# Altium project ddrlegobrick.PrjPcb (part 1 of 2)
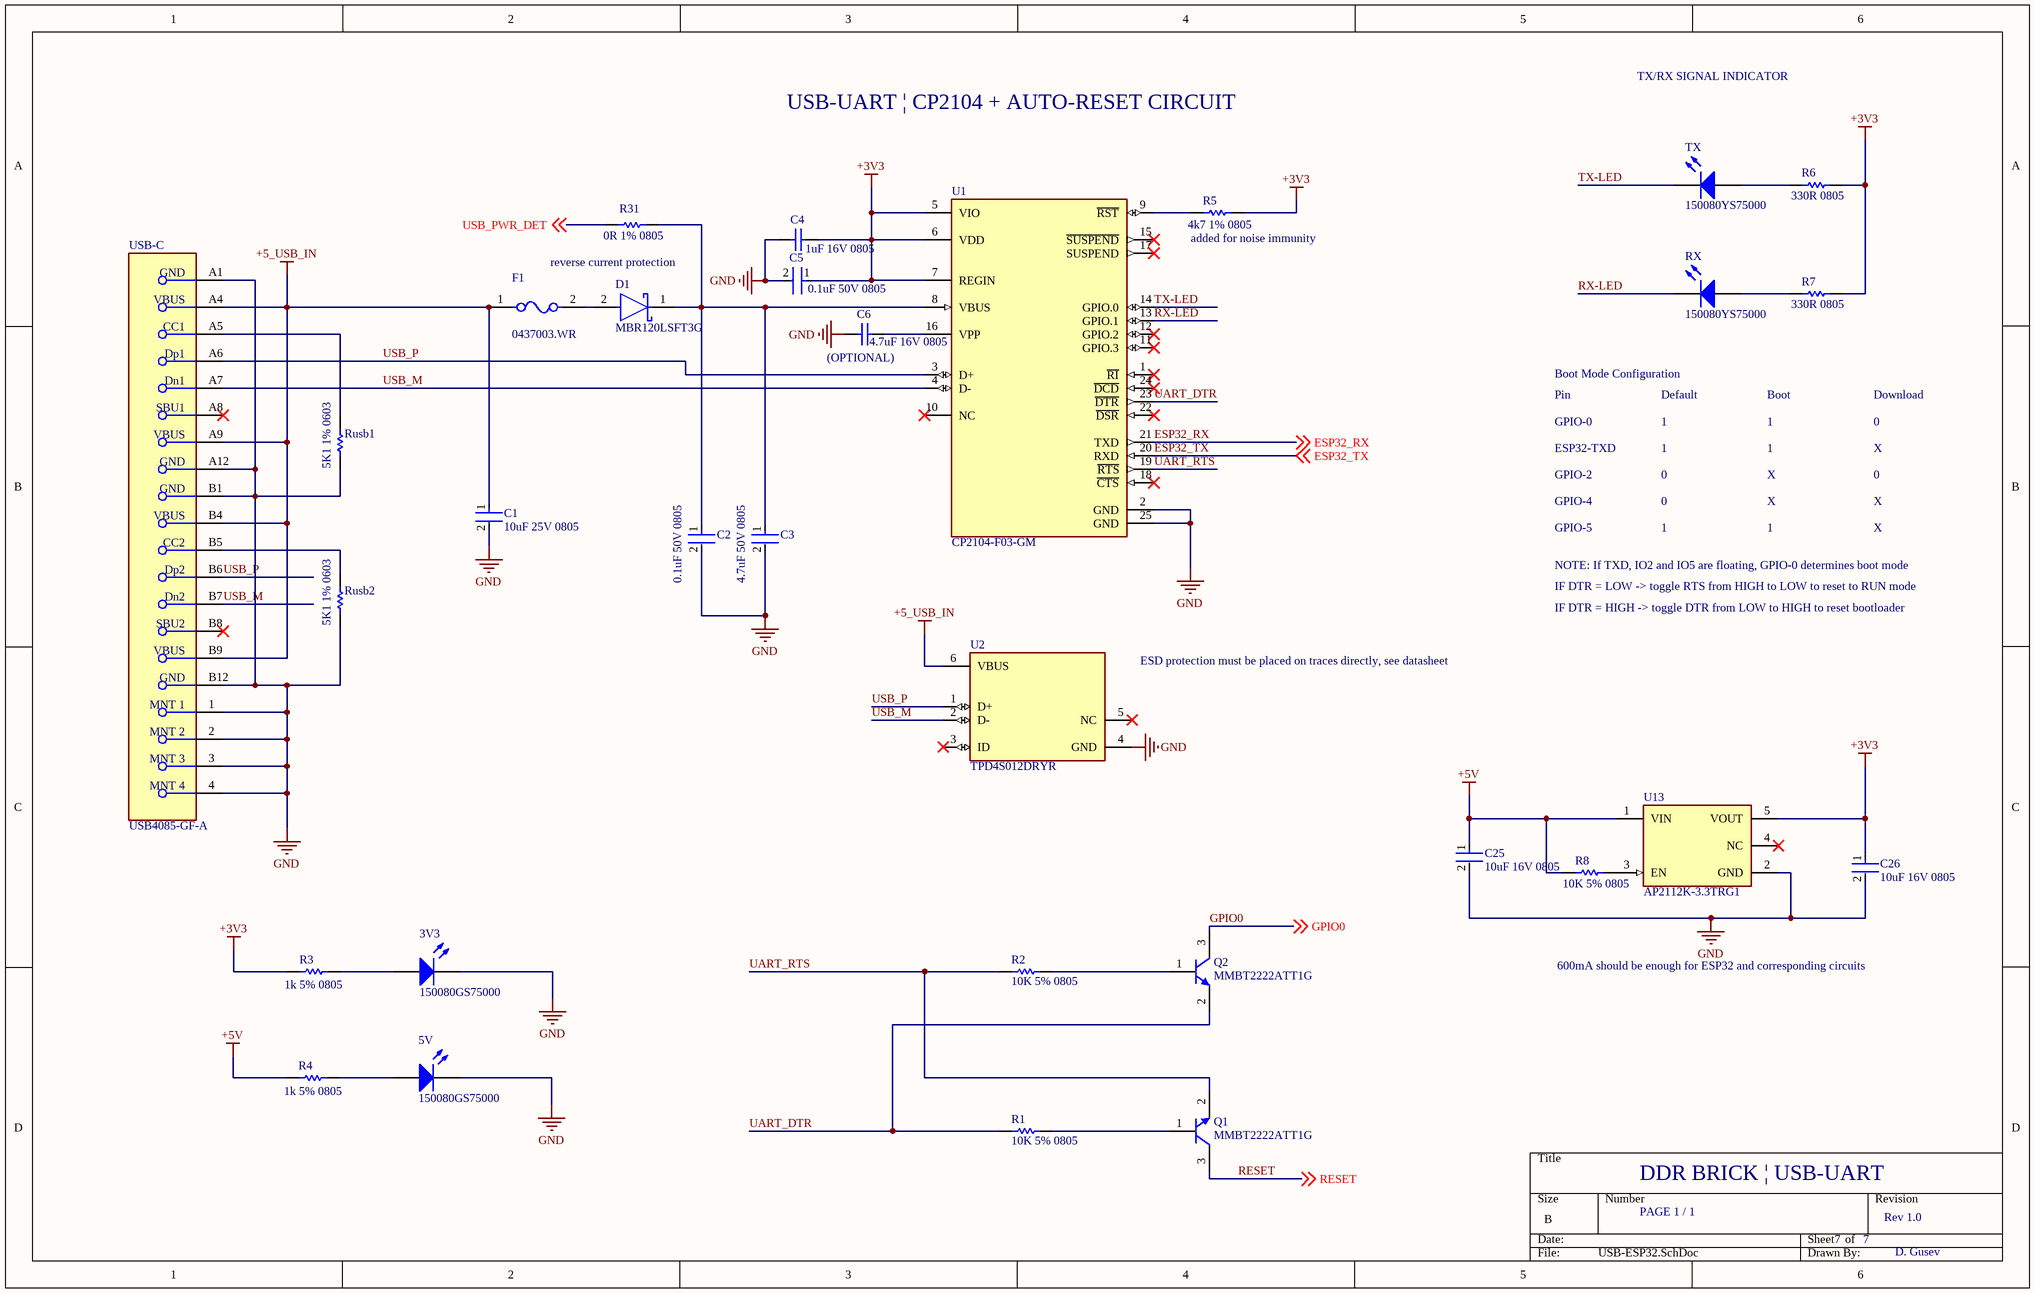
[diagram p0: USB-ESP32.SchDoc]
7 sheets, 106 parts. Net scope: global (net labels, ports and power ports of the same name join across sheets).
Board file: ddrlegobrick.PcbDoc
Sheets:
  USB-ESP32.SchDoc
  ESP32.SchDoc
  GPIO_EXT.SchDoc
  DRV8833.SchDoc
  CONN.SchDoc
  CHARGING.SchDoc
  POWER_REG.SchDoc

## Sheet USB-ESP32.SchDoc
size B

### Parts
3V3  150080GS75000  [0805_A]
5V  150080GS75000  [0805_A]
C1  10uF 25V 0805  [FP-GRM21B-0_15-IPC_C]
C2  0.1uF 50V 0805  [FP-C0805C-DN-MFG]
C3  4.7uF 50V 0805  [FP-C2012-125-MFG]
C4  1uF 16V 0805  [CAPC2013X145X50LL20T25]
C5  0.1uF 50V 0805  [FP-C0805C-DN-MFG]
C6  4.7uF 16V 0805  [CAPC2013X140X50LL20T25]
C25  10uF 16V 0805  [FP-GRM21B-0_1-IPC_C]
C26  10uF 16V 0805  [FP-GRM21B-0_1-IPC_C]
D1  MBR120LSFT3G  [FP-498-MFG]
F1  0437003.WR  [FP-437-MFG]
Q1  MMBT2222ATT1G  [ONSC-SC-75-3-463-01_V]
Q2  MMBT2222ATT1G  [ONSC-SC-75-3-463-01_V]
R1  10K 5% 0805  [RESC2013X60X40ML20T25]
R2  10K 5% 0805  [RESC2013X60X40ML20T25]
R3  1k 5% 0805  [RESC2013X60X35ML10T20]
R4  1k 5% 0805  [RESC2013X60X35ML10T20]
R5  4k7 1% 0805  [YAGO-RC0805_M]
R6  330R 0805  [RESC2013X60X35LL10T20]
R7  330R 0805  [RESC2013X60X35LL10T20]
R8  10K 5% 0805  [RESC2013X60X40ML20T25]
R31  0R 1% 0805  [RESC2013X60X35ML10T20]
Rusb1  5K1 1% 0603  [RESC1608X55X25ML10T15]
Rusb2  5K1 1% 0603  [RESC1608X55X25ML10T15]
RX  150080YS75000  [0805_A]
TX  150080YS75000  [0805_A]
U1  CP2104-F03-GM  [FP-CP2104-F03-GM-MFG]
U2  TPD4S012DRYR  [FP-DRY0006A-MFG]
U13  AP2112K-3.3TRG1  [FP-SOT25-IPC_A]
USB-C  USB4085-GF-A  [FP-USB4085-GF-A-MFG]

### Nets
+3V3: C4.2 C5.1 C26.1 R3.1 R5.2 R6.2 R7.2 U1.5(VIO) U1.6(VDD) U1.7(REGIN) U13.5(VOUT)
+5_USB_IN: C1.1 F1.1 U2.6(VBUS) USB-C.A4(VBUS) USB-C.A9(VBUS) USB-C.B4(VBUS) USB-C.B9(VBUS)
+5V: C25.1 R4.1 R8.2 U13.1(VIN)
GND: 3V3.1(K) 5V.1(K) C1.2 C2.2 C3.2 C4.1 C5.2 C6.2 C25.2 C26.2 Rusb1.1 Rusb2.1 U1.2(GND) U1.25(GND) U2.4(GND) U13.2(GND) USB-C.1(MNT_1) USB-C.2(MNT_2) USB-C.3(MNT_3) USB-C.4(MNT_4) USB-C.A1(GND) USB-C.A12(GND) USB-C.B1(GND) USB-C.B12(GND)
ESP32_RX: U1.21(TXD) ; off-sheet ESP32_RX
ESP32_TX: U1.20(RXD) ; off-sheet ESP32_TX
GPIO0: Q2.3(C) ; off-sheet GPIO0
RESET: Q1.3(C) ; off-sheet RESET
RX-LED: RX.1(K) U1.13(GPIO.1)
TX-LED: TX.1(K) U1.14(GPIO.0)
UART_DTR: Q2.2(E) R1.2 U1.23(~{DTR})
UART_RTS: Q1.2(E) R2.2 U1.19(~{RTS})
USB_M: U1.4(D-) U2.2(D-) USB-C.A7(Dn1) USB-C.B7(Dn2)
USB_P: U1.3(D+) U2.1(D+) USB-C.A6(Dp1) USB-C.B6(Dp2)
USB_PWR_DET: R31.1 ; off-sheet USB_PWR_DET
Net3V3_2: 3V3.2(A) R3.2
Net5V_2: 5V.2(A) R4.2
NetC2_1: C2.1 C3.1 D1.1(C) R31.2 U1.8(VBUS)
NetC6_1: C6.1 U1.16(VPP)
NetD1_2: D1.2(A) F1.2
NetQ1_1: Q1.1(B) R1.1
NetQ2_1: Q2.1(B) R2.1
NetR5_1: R5.1 U1.9(~{RST})
NetR6_1: R6.1 TX.2(A)
NetR7_1: R7.1 RX.2(A)
NetR8_1: R8.1 U13.3(EN)
NetRusb1_2: Rusb1.2 USB-C.A5(CC1)
NetRusb2_2: Rusb2.2 USB-C.B5(CC2)

Not connected (* = marked no-connect by the designer): U1 1(~{RI})* 10(NC)* 11(GPIO.3)* 12(GPIO.2)* 15(~{SUSPEND})* 17(SUSPEND)* 18(~{CTS})* 22(~{DSR})* 24(~{DCD})*; U2 3(ID)* 5(NC)*; U13 4(NC)*; USB-C A8(SBU1)* B8(SBU2)*

### Notes on the sheet
- TX/RX SIGNAL INDICATOR
- USB-UART | CP2104 + AUTO-RESET CIRCUIT
- reverse current protection
- (near R5) added for noise immunity
- (near C6) (OPTIONAL)
- Boot Mode Configuration
- Pin
- GPIO-0
- Default
- 1
- Boot
- Download
- 0
- ESP32-TXD
- GPIO-2
- GPIO-4
- X
- GPIO-5
- NOTE: If TXD, IO2 and IO5 are floating, GPIO-0 determines boot mode
- IF DTR = LOW -> toggle RTS from HIGH to LOW to reset to RUN mode
- IF DTR = HIGH -> toggle DTR from LOW to HIGH to reset bootloader
- (near U2) ESD protection must be placed on traces directly, see datasheet
- 600mA should be enough for ESP32 and corresponding circuits
- DDR BRICK | USB-UART
- PAGE 1 / 1
- 7
- Rev 1.0
- D. Gusev

### Library data of the parts
3V3 5V = CMP-1426-00007-1: SMD mono-color Chip LED, WL-SMCW, Green; Manufacturer: Wuerth Elektronik; PackageReference: 0805_A; Color: Green; PartNumber: 150080GS75000; ComponentLink2URL: http://katalog.we-online.com/led/datasheet/150080GS75000.pdf; ComponentLink1URL: http://www.we-online.com; ComponentLink1Description: Manufacturer URL; ComponentLink2Description: Datasheet
C1 = CMP-2007-03541-2: Chip Multilayer Ceramic Capacitors for General Purpose, 0805, 10uF, X5R, 15%, 10%, 25V; Length: 2mm; Depth: 1.25mm; Termination: SMD/SMT; Voltage: 25V; Height: 1.25mm; Material: Ceramic; Thickness: 0.053inch; Radiation Hardening: No; Min Operating Temperature: -55°C; Width: 0.049inch; Package Quantity: 1; Mount: Surface Mount; Dielectric: X5R; Packaging: Tape and Reel; Capacitance: 10uF; Voltage Rating (DC): 25V; Lead Free: Lead Free; Max Operating Temperature: 85°C; Case Code (Imperial): 0805; Case/Package: 0805; Tolerance: 10%; Voltage Rating: 25V; Case Code (Metric): 2012
C2 C5 = CMP-2007-00279-2: CAP CER 0.1UF 50V X7R 0805; Manufacturer Part Number: C0805C104K5RACTU; Manufacturer: KEMET; Value: 0.10 μF; Tolerance: 0.1; Temperature Coefficient: 30ppm/°C; Material: Ceramic; Device Class L2: Capacitors; Temperature Range Low: -55°C; Voltage Rating: 50 V; Digikey Description: CAP CER 0.1UF 50V X7R 0805; Category: Cap; ComponentLink2Description: Datasheet; Octopart: https://octopart.com/c0805c104k5ractu-kemet-143926; RoHS: TRUE; ComponentLink2URL: https://content.kemet.com/datasheets/KEM_C1003_C0G_SMD.pdf; Temperature Characteristic: X7R; Temperature: -55°C to +125°C; Height: 0.88mm; Temperature Range High: +125°C; Device Class L1: Passive Components; Automotive: No; Lead Free: Yes; Ipc Land Pattern Name: CAPC200125X78; Device Class L3: Ceramic Capacitors; Mouser Description: Cap Ceramic 0.1uF 50V X7R 10% SMD 2.0 x 1.2 mm 125 C Paper T/R; Capacitance: 0.10 μF; Package: C0805C-DN
C3 = CMP-08246-000007-1: CAP CER 4.7UF 50V X5R 0805; Manufacturer Part Number: C2012X5R1H475K125AB; Manufacturer: TDK Corporation; Tolerance: 10%; Temperature Coefficient: 15%; Material: Ceramic; Mouser Description: Multilayer Ceramic Capacitors MLCC - SMD/SMT 0805 4.7uF 50volts X5R 10%; Category: Cap; Temperature Range High: +85°C; Digikey Description: CAP CER 4.7UF 50V X5R 0805; Voltage Rating: 50V; Device Class L1: Passive Components; Temperature Range Low: -55°C; Lead Free: Yes; ComponentLink2Description: Datasheet; Capacitance: 4.7uF; Octopart: https://octopart.com/c2012x5r1h475k125ab-tdk-25947720; Device Class L2: Capacitors; Value: 4.7uF; Temperature: -55°C to +85°C; ComponentLink2URL: https://product.tdk.com/info/en/catalog/datasheets/mlcc_commercial_general_en.pdf; RoHS: TRUE; Height: 1.45mm; Temperature Characteristic: X5R; Package: C2012-125; Device Class L3: Ceramic Capacitors; Automotive: No
C4 = CMP-1036-04746-2: Manufacturer: Kemet; Part Number: C0805C105K4PACTU
C6 = CMP-2007-03297-1: Part Number: C0805C475K4PACTU; Manufacturer: Kemet
C25 C26 = CMP-2007-03453-2: Chip Multilayer Ceramic Capacitors for General Purpose, 0805, 10uF, X5R, 15%, 10%, 16V; Radiation Hardening: No; Thickness: 0.053inch; Voltage Rating (DC): 16V; Lead Free: Lead Free; Package Quantity: 1; Width: 1.25mm; Case Code (Imperial): 0805; Depth: 1.25mm; Packaging: Tape and Reel; Dielectric: X5R; Max Operating Temperature: 85°C; Tolerance: 10%; Voltage Rating: 16V; Voltage: 16V; Capacitance: 10uF; Height: 1.25mm; Case Code (Metric): 2012; Material: Ceramic; Mount: Surface Mount; Case/Package: 0805; REACH SVHC: No SVHC; Length: 2mm; Min Operating Temperature: -55°C; Termination: SMD/SMT
D1 = CMP-1055-00451-2: DIODE SCHOTTKY 20V 1A SOD123L; Max Forward Surge Current (Ifsm): 50A; Polarity: Standard; Element Configuration: Single; Forward Voltage: 650mV; Max Reverse Current: 25mA; Max Reverse Leakage Current: 400uA; Height: 0.9mm; Radiation Hardening: No; Max Surge Current: 50A; Max Reverse Voltage (DC): 20V; Min Operating Temperature: -55°C; Length: 2.9mm; Output Current: 1A; Package Quantity: 10000; Halogen Free: Halogen Free; Packaging: Tape and Reel; Forward Current: 1A; Series: -; Current Rating: 1A; Voltage Rating (DC): 20V; Average Rectified Current: 1A; Peak Non-Repetitive Surge Current: 50A; Max Operating Temperature: 125°C; Mount: Surface Mount; Max Repetitive Reverse Voltage (Vrrm): 20V; Lead Free: Lead Free; Width: 1.8mm; Number of Pins: 2
F1 = CMP-08605-000049-1: FUSE BRD MNT 3A 32VAC 35VDC 1206; Manufacturer: Littelfuse Inc; Fuse Interrupt Ac Current: 50A; Value: 0.033Ω; Fuse Blow Speed: Fast; Voltage Rating: 32V; Max Fuse Dc Voltage: 35V; Fuse I2T: 0.506A2Sec; Fuse Voltage Drop: 0.14V; Octopart: https://octopart.com/0437003.wr-littelfuse-8600121; Category: Fuse; Fuse Interrupt Dc Current: 50A; Temperature: -55°C to +150°C; Device Class L1: Circuit Protection; Fuse Current: 3A; Temperature Range High: +150°C; Temperature Range Low: -55°C; Resistance: 0.033Ω; Automotive: No; ComponentLink2URL: https://www.littelfuse.com/~/media/electronics/datasheets/fuses/littelfuse_fuse_437_datasheet.pdf.pdf; Manufacturer Part Number: 0437003.WR; Ipc Land Pattern Name: CAPC320163X82; Mouser Description: Surface Mount Fuses 32V FA 1206 3A; Device Class L2: Fuses; Device Class L3: unset; Package: 437; RoHS: TRUE; Height: 0.8639mm; Digikey Description: FUSE BRD MNT 3A 32VAC 35VDC 1206; ComponentLink2Description: Datasheet; Lead Free: Yes; Max Fuse Ac Voltage: 32V
Q1 Q2 = CMP-1048-00417-1: General Purpose Transistor, NPN Silicon, 3-Pin SC-75, Pb-Free, Tape and Reel; Manufacturer: On Semiconductor; IC Continuous (A): 0.6; fT Min (MHz): 300; DatasheetVersion: Rev. 5; PackageVersion: Rev. F, 07/2005; ComponentLink1Description: Manufacturer URL; RoHS: TRUE; Packing: Tape and Reel; ComponentLink3URL: http://www.onsemi.com/pub_link/Collateral/463-01.PDF; ComponentLink1URL: http://www.onsemi.com/; ComponentLink3Description: Package Specification; ComponentLink2URL: http://www.onsemi.cn/pub_link/Collateral/MMBT2222ATT1-D.PDF; Mounting Technology: Surface Mount; PartNumber: MMBT2222ATT1G; ComponentLink2Description: Datasheet; Polarity: NPN; PackageReference: SC-75-3-463-01; PackageDescription: 3-Pin Small Outline Transistor, Body 1.6 x 0.8 mm, Pitch 0.5 mm
R1 R2 R8 = CMP-2001-00590-1: Part Number: ERA6AEB123V; Manufacturer: Panasonic
R3 R4 = CMP-2100-03671-1: Chip Resistor, 1 KOhm, +/- 1%, 125 mW, -55 to 155 degC, 0805 (2012 Metric), RoHS, Tape and Reel; Manufacturer: Yageo; Temperature Coefficient: 100ppm/degreesC; Voltage Rating (DC): 150V; Max Power Dissipation: 125mW; Resistance: 1KOhm; Number of Pins: 2; Number of Terminations: 2; Datasheet URL: http://www.yageo.com/NewPortal/yageodocoutput?fileName=/pdf/R-Chip/PYu-RC_Group_51_RoHS_L_5.pdf; Length: 0.079inch; Package Description: 2-Pin Surface Mounted Device, Body 2 x 1.25 mm; Depth: 1.25mm; Height: 0.024inch; Military Standard: Not; Case/Package: 0805; Package Reference: 0805; RoHSCompliant: true; Lead Free: LeadFree; Packaging: TapeandReel; Package Quantity: 1; Datasheet Version: Rev. 5, 10/2016; Tolerance: 1%; Min Operating Temperature: -55degC; Voltage Rating: 150V; Composition: ThickFilm; Case Code (Imperial): 0805; Power Rating: 125mW; Width: 0.049inch; Case Code (Metric): 2012; Manufacturer URL: http://www.yageo.com/; Max Operating Temperature: 155degC; REACH SVHC: Unknown; Termination: SMD/SMT
R5 = CMP-1568-00001-1: General Puprose Chip Resistor, 4700 Ohm +/- 1%, 0.125 W, -55 to 155 degC, 2-Pin SMD, RoHS, Tape and Reel; PartNumber: RC0805FR-074K7L; Tolerance: +/- 1%; Power: 0.125 W; PackageDescription: 2-Pin Surface Mount Device, Body 2 x 1.25 mm; ComponentLink2URL: http://www.yageo.com/documents/recent/PYu-RC_Group_51_RoHS_L-3.pdf; Temperature Min: -55 degC; Packing: Tape and Reel; Mounting Technology: Surface Mount; ComponentLink1URL: http://www.yageo.com/NewPortal/_en/index.jsp; Resistance: 4700 Ohm; Temperature Max: 155 degC; ComponentLink2Description: Datasheet; DatasheetVersion: Rev. 3; RoHS: TRUE; ComponentLink1Description: Manufacturer URL
R6 R7 = CMP-2000-06960-1: Chip Resistor, 330 Ohm, +/- 1%, 125 mW, -55 to 155 degC, 0805 (2012 Metric), RoHS, Tape and Reel; Manufacturer: Yageo; Voltage Rating: 150V; Temperature Coefficient: 100PPM/C; Power Rating: 125mW(1/8W); Resistance: 330Ohms; Datasheet Version: Rev. 7, 05/2017; Termination Style: SMD/SMT; Case Code - mm: 2012; Package Description: 2-Pin Surface Mounted Device, Body 2 x 1.25 mm; Operating Temperature Range: -55Cto+155C; Case Code - in: 0805; Packaging: Reel; Tolerance: 1%; Package Reference: 0805; Mounting Technology: SurfaceMount; Product: ThickFilmResistorsGeneralPurpose; Series: RC; Manufacturer URL: http://www.yageo.com/; Datasheet URL: http://www.yageo.com/documents/recent/PYu-RC_Group_51_RoHS_L_7.pdf
R31 = CMP-2100-03673-1: Chip Resistor, 0 Ohm, Jumper, +/- 5%, 0.125 W, -55 to 155 degC, 0805 (2012 Metric), RoHS, Tape and Reel; Manufacturer: Yageo; Power Rating: 125mW; Resistance: 0mOhm; Voltage Rating (DC): 150V; Temperature Coefficient: 200ppm/degreesC; Height: 0.5mm; Depth: 1.25mm; Case Code (Imperial): 0805; Lead Free: LeadFree; Military Standard: Not; Package Description: 2-Pin Surface Mounted Device, Body 2 x 1.25 mm; Case Code (Metric): 2012; Composition: ThickFilm; Voltage Rating: 150V; Manufacturer URL: http://www.yageo.com/; Packaging: TapeandReel; Package Reference: 0805; REACH SVHC: Unknown; Tolerance: 5%; Case/Package: 0805; Max Operating Temperature: 155degC; Number of Pins: 2; Min Operating Temperature: -55degC; RoHSCompliant: true; Length: 2mm; Datasheet URL: http://www.yageo.com/NewPortal/yageodocoutput?fileName=/pdf/R-Chip/PYu-RC_Group_51_RoHS_L_5.pdf; Termination: SMD/SMT; Radiation Hardening: No; Width: 1.25mm; Contact Plating: Tin; Datasheet Version: Rev. 5, 10/2016
Rusb1 Rusb2 = CMP-2000-04091-1: Manufacturer: Yageo; Part Number: RC0603FR-075K1L
RX TX = CMP-1426-00012-1: SMD mono-color Chip LED, WL-SMCW, Yellow; Manufacturer: Wuerth Elektronik; Color: Yellow; ComponentLink1URL: http://www.we-online.com; PackageReference: 0805_A; ComponentLink2URL: http://katalog.we-online.com/led/datasheet/150080YS75000.pdf; ComponentLink1Description: Manufacturer URL; ComponentLink2Description: Datasheet; PartNumber: 150080YS75000
U1 = CMP-0511-00004-2: IC SGL USB-TO-UART BRIDGE 24QFN; Number of Transceivers: 1; Max Supply Voltage: 3.6V; Operating Supply Current: 17mA; Operating Supply Voltage: 3.3V; Data Rate: 2Mbps; Min Supply Voltage: 3V; Number of Channels: 1; Max Operating Temperature: 85°C; Contact Plating: Tin; Min Operating Temperature: -40°C; Number of Pins: 24; Case/Package: QFN; Packaging: Rail/Tube; Radiation Hardening: No; Weight: 0.001764oz
U2 = CMP-0326-00038-4: TVS DIODE 5.5V 6SON; Breakdown Voltage: 24V; Interface: USB; ESD Protection: Yes; Peak Pulse Power: 60W; Number of Circuits: 4; Polarity: Unidirectional; Capacitance: 15pF; Test Current: 1mA; Working Voltage: 19V; Min Breakdown Voltage: 6V; Peak Pulse Current: 3A; Operating Supply Voltage: 950mV; Max Operating Temperature: 85°C; Packaging: Tape and Reel; Termination: SMD/SMT; Number of Pins: 6; Radiation Hardening: No; Width: 1.05mm; REACH SVHC: No SVHC; Lead Free: Lead Free; Depth: 1mm; Package Quantity: 5000; Length: 1.45mm; Direction: Unidirectional; Min Operating Temperature: -40°C; Number of Channels: 4; Max Power Dissipation: 60W; Height: 0.55mm
U13 = CMP-12756-000035-1: IC REG LINEAR 3.3V 600MA SOT25; Number of Regulators: 1; Output Type: Fixed; Polarity: Positive; Min Input Voltage: 2.5V; Max Input Voltage: 6V; Accuracy: 1.5%; Quiescent Current: 55uA; Dropout Voltage: 250mV; Min Operating Temperature: -40°C; Length: 3.1mm; Output Current: 600mA; Max Operating Temperature: 85°C; Package Quantity: 1; Output Voltage: 3.3V; Width: 1.7mm; Number of Outputs: 1; Packaging: Tape and Reel; Height: 1.3mm; Lead Free: Lead Free; Max Output Current: 600mA; Case/Package: SOT-23-5; Mount: Surface Mount; Number of Pins: 5
USB-C = CMP-196119-000001-1: CONN RCPT USB2.0 TYPEC 16POS; Manufacturer: Global Connector Technology; Voltage Rating: 20V; Conn Orientation: Right Angle; Shielding: true; Current Rating: 4.25A; Number Of Contacts: 16; Pitch: 0.85mm; Is Female: yes; ComponentLink2URL: https://gct.co/files/drawings/usb4085.pdf; Category: Conn; Automotive: No; ComponentLink2Description: Datasheet; Height: 3.66mm; Manufacturer Part Number: USB4085-GF-A; Package: 0; Usb Standard: USB 2.0; Octopart: https://octopart.com/usb4085-gf-a-global+connector+technology-94773699; Device Class L3: unset; Digikey Description: CONN RCPT USB2.0 TYPEC 16POS; Temperature Range Low: -40°C; Temperature: -40°C to +85°C; Lead Free: Yes; Contact Material: Gold,Nickel; Device Class L1: Connectors; Temperature Range High: +85°C; Device Class L2: USB Connectors; RoHS: TRUE

## Sheet ESP32.SchDoc
size B
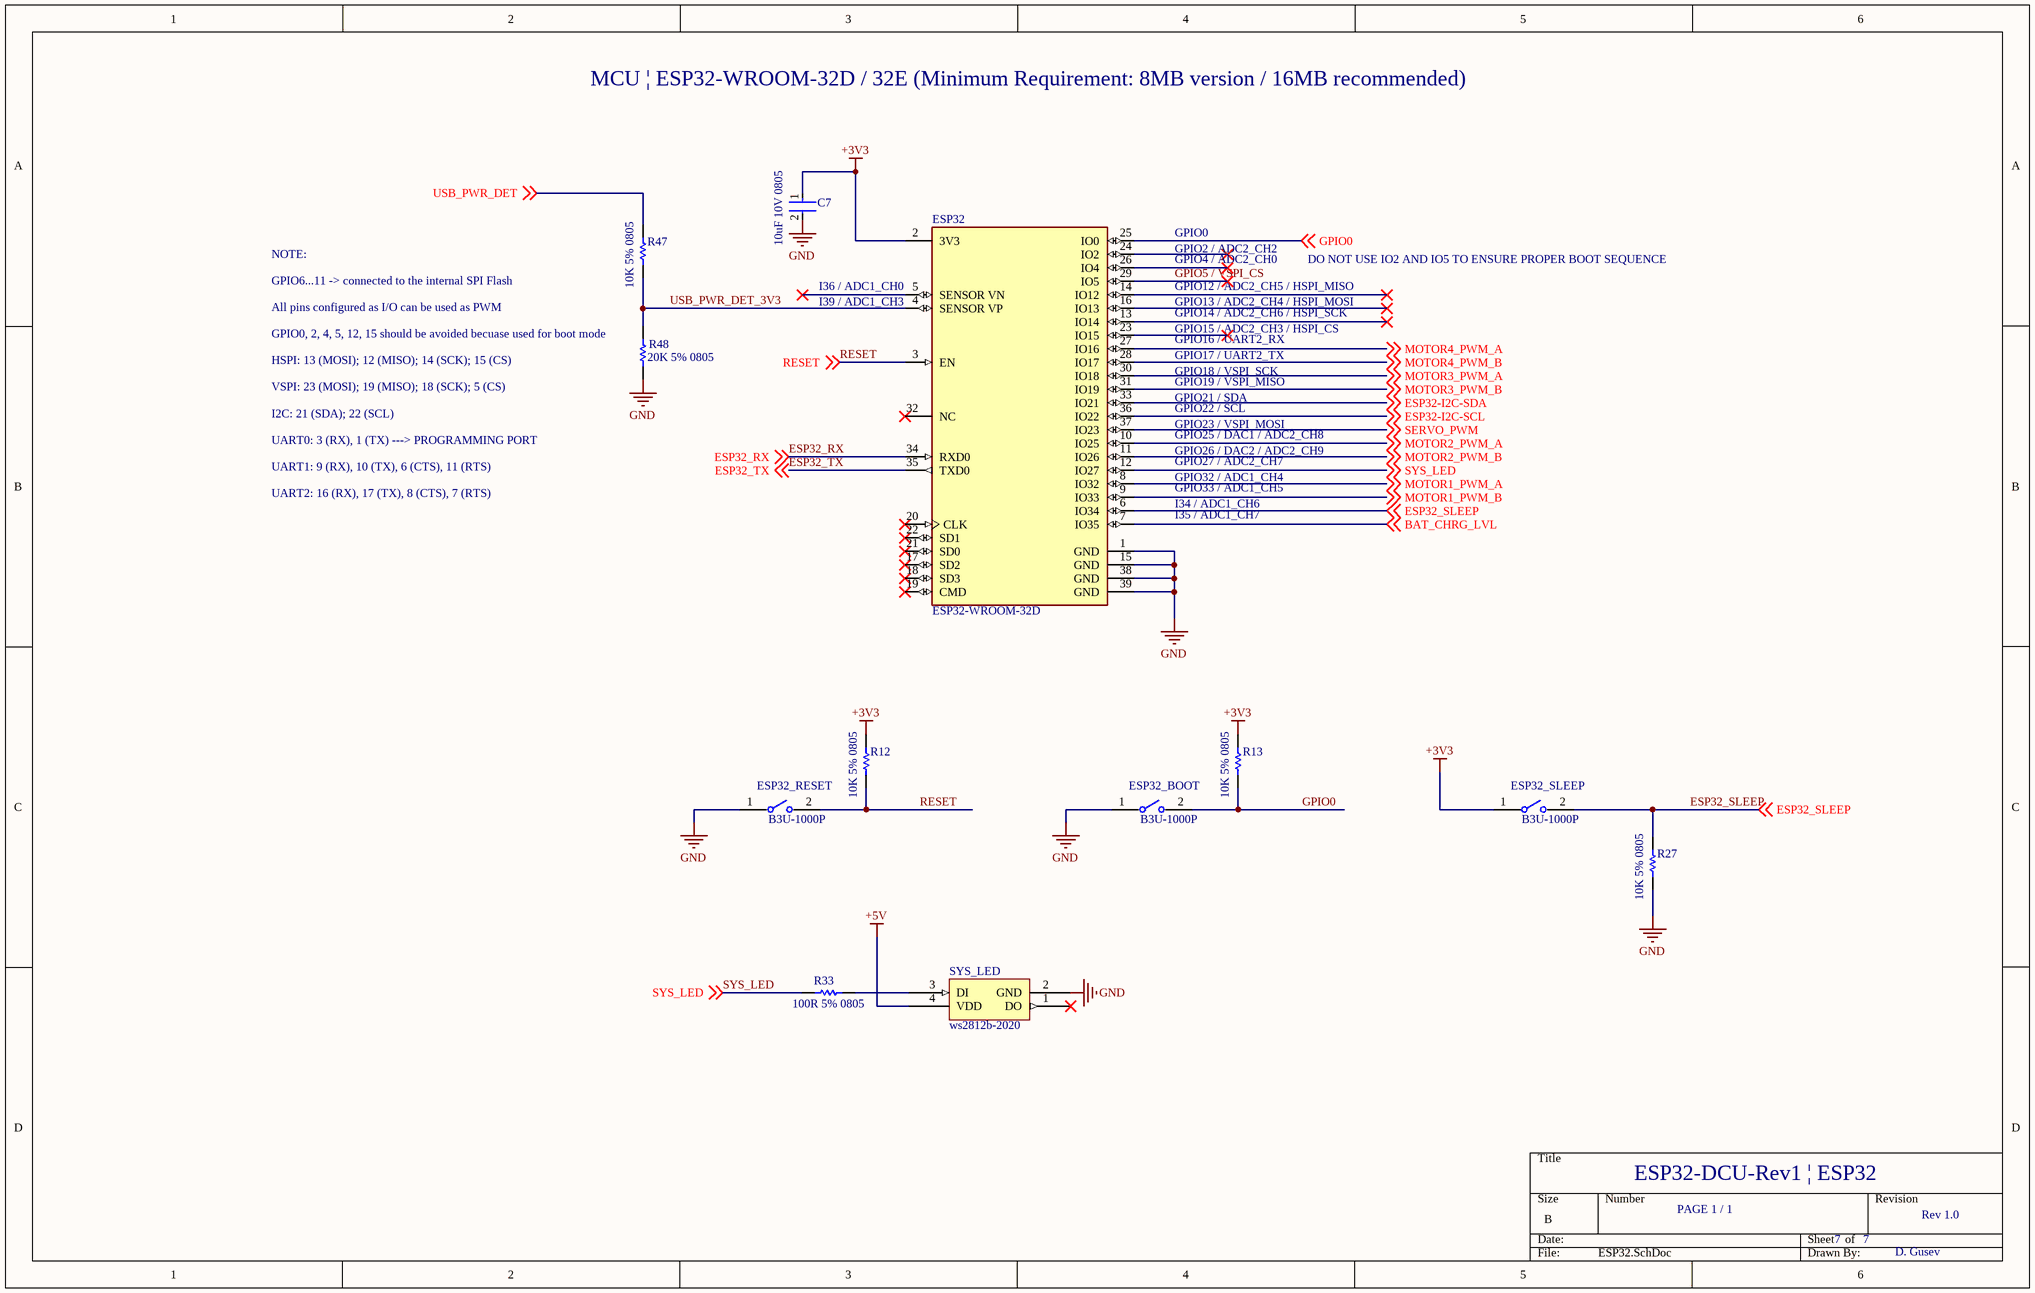
[diagram p1: ESP32.SchDoc]

### Parts
C7  10uF 10V 0805  [FP-C0805C-DG-MFG]
ESP32  ESP32-WROOM-32D  [ESP32-WROOM-U]
ESP32_BOOT  B3U-1000P  [FP-B3U-1000P-MFG]
ESP32_RESET  B3U-1000P  [FP-B3U-1000P-MFG]
ESP32_SLEEP  B3U-1000P  [FP-B3U-1000P-MFG]
R12  10K 5% 0805  [RESC2013X60X40ML20T25]
R13  10K 5% 0805  [RESC2013X60X40ML20T25]
R27  10K 5% 0805  [RESC2013X60X40ML20T25]
R33  100R 5% 0805  [RESC2013X60X35ML10T20]
R47  10K 5% 0805  [RESC2013X60X40ML20T25]
R48  20K 5% 0805  [RESC0805(2012)_N]
SYS_LED  ws2812b-2020  [ws2812b]

### Nets
+3V3: C7.1 ESP32.2(3V3) ESP32_SLEEP.1 R12.2 R13.2
+5V: SYS_LED.4(VDD)
GND: C7.2 ESP32.1(GND) ESP32.15(GND) ESP32.38(GND) ESP32.39(GND) ESP32_BOOT.1 ESP32_RESET.1 R27.1 R48.1 SYS_LED.2(GND)
BAT_CHRG_LVL: ESP32.7(IO35) ; off-sheet BAT_CHRG_LVL
ESP32-I2C-SCL: ESP32.36(IO22) ; off-sheet ESP32-I2C-SCL
ESP32-I2C-SDA: ESP32.33(IO21) ; off-sheet ESP32-I2C-SDA
ESP32_RX: ESP32.34(RXD0) ; off-sheet ESP32_RX
ESP32_SLEEP: ESP32.6(IO34) ESP32_SLEEP.2 R27.2 ; off-sheet ESP32_SLEEP
ESP32_TX: ESP32.35(TXD0) ; off-sheet ESP32_TX
GPIO0: ESP32.25(IO0) ESP32_BOOT.2 R13.1 ; off-sheet GPIO0
GPIO5 / VSPI_CS: ESP32.29(IO5)
MOTOR1_PWM_A: ESP32.8(IO32) ; off-sheet MOTOR1_PWM_A
MOTOR1_PWM_B: ESP32.9(IO33) ; off-sheet MOTOR1_PWM_B
MOTOR2_PWM_A: ESP32.10(IO25) ; off-sheet MOTOR2_PWM_A
MOTOR2_PWM_B: ESP32.11(IO26) ; off-sheet MOTOR2_PWM_B
MOTOR3_PWM_A: ESP32.30(IO18) ; off-sheet MOTOR3_PWM_A
MOTOR3_PWM_B: ESP32.31(IO19) ; off-sheet MOTOR3_PWM_B
MOTOR4_PWM_A: ESP32.27(IO16) ; off-sheet MOTOR4_PWM_A
MOTOR4_PWM_B: ESP32.28(IO17) ; off-sheet MOTOR4_PWM_B
RESET: ESP32.3(EN) ESP32_RESET.2 R12.1 ; off-sheet RESET
SERVO_PWM: ESP32.37(IO23) ; off-sheet SERVO_PWM
SYS_LED: ESP32.12(IO27) R33.1 ; off-sheet SYS_LED
USB_PWR_DET: R47.2 ; off-sheet USB_PWR_DET
USB_PWR_DET_3V3: ESP32.4(SENSOR_VP) R47.1 R48.2
NetR33_2: R33.2 SYS_LED.3(DI)

Not connected (* = marked no-connect by the designer): ESP32 5(SENSOR_VN)* 13(IO14)* 14(IO12)* 16(IO13)* 17(SD2)* 18(SD3)* 19(CMD)* 20(CLK)* 21(SD0)* 22(SD1)* 23(IO15)* 24(IO2)* 26(IO4)* 32(NC)*; SYS_LED 1(DO)*

### Notes on the sheet
- MCU | ESP32-WROOM-32D / 32E (Minimum Requirement: 8MB version / 16MB recommended)
- GPIO0
- NOTE:
- GPIO6...11 -> connected to the internal SPI Flash
- (near ESP32) I36 / ADC1_CH0
- GPIO2 / ADC2_CH2
- GPIO4 / ADC2_CH0
- GPIO12 / ADC2_CH5 / HSPI_MISO
- DO NOT USE IO2 AND IO5 TO ENSURE PROPER BOOT SEQUENCE
- All pins configured as I/O can be used as PWM
- (near R48) GPIO0, 2, 4, 5, 12, 15 should be avoided becuase used for boot mode
- HSPI: 13 (MOSI); 12 (MISO); 14 (SCK); 15 (CS)
- (near ESP32) I39 / ADC1_CH3
- GPIO13 / ADC2_CH4 / HSPI_MOSI
- GPIO14 / ADC2_CH6 / HSPI_SCK
- GPIO15 / ADC2_CH3 / HSPI_CS
- GPIO16 / UART2_RX
- GPIO17 / UART2_TX
- VSPI: 23 (MOSI); 19 (MISO); 18 (SCK); 5 (CS)
- I2C: 21 (SDA); 22 (SCL)
- GPIO18 / VSPI_SCK
- GPIO19 / VSPI_MISO
- GPIO21 / SDA
- GPIO22 / SCL
- GPIO23 / VSPI_MOSI
- GPIO25 / DAC1 / ADC2_CH8
- UART0: 3 (RX), 1 (TX) ---> PROGRAMMING PORT
- UART1: 9 (RX), 10 (TX), 6 (CTS), 11 (RTS)
- UART2: 16 (RX), 17 (TX), 8 (CTS), 7 (RTS)
- GPIO26 / DAC2 / ADC2_CH9
- GPIO27 / ADC2_CH7
- GPIO32 / ADC1_CH4
- GPIO33 / ADC1_CH5
- I34 / ADC1_CH6
- I35 / ADC1_CH7
- ESP32-DCU-Rev1 | ESP32
- PAGE 1 / 1
- 7
- Rev 1.0
- D. Gusev

### Library data of the parts
C7 = CMP-2007-03243-2: CAP CER 10UF 10V X5R 0805; Manufacturer Part Number: C0805C106K8PACTU; Manufacturer: Kemet; 3DS Part Number: 220-00001; Tolerance: 10%; Temperature Coefficient: 15%; Material: Ceramic; Device Class L2: Capacitors; Device Class L1: Passive Components; ComponentLink2URL: https://content.kemet.com/datasheets/KEM_C1006_X5R_SMD.pdf; Height: 1.4mm; Lead Free: Yes; Digikey Description: CAP CER 10UF 10V X5R 0805; Octopart: https://octopart.com/c0805c106k8pactu-kemet-98697; Capacitance: 10uF; Value: 10uF; Temperature Range Low: -55°C; Temperature: -55°C to +85°C; Automotive: No; Mouser Description: CAP CER 10UF 10V X5R 0805; Ipc Land Pattern Name: CAPC200125X125; Temperature Range High: +85°C; Voltage: 10V; RoHS: TRUE; Device Class L3: Ceramic Capacitors; ComponentLink2Description: Datasheet; Voltage Rating: 10V; Package: C0805C-DG; Temperature Characteristic: X5R; Category: Cap
ESP32 = ESP32-WROOM-U: WIFI MODULE 32MBITS SPI FLASH; Manufacturer: Espressif Systems; Max Supply Voltage: 3.6V; Nominal Supply Current: 500mA; Max Frequency: 2484MHz; Number Of Adc Channels: 16; Number Of Gpio: 32; Interface: I2C,SPI,UART,Ethernet,I2S,Other; Data Rate: 150Mbits/s; Min Supply Voltage: 3V; Bandwidth: 72MHz; Sensitivity: -98dBm; Octopart: https://octopart.com/esp32-wroom-32d-espressif+systems-91040050; Package: ESP32-WROOM-32D; ComponentLink2URL: https://www.espressif.com/sites/default/files/documentation/esp32-wroom-32d_esp32-wroom-32u_datasheet_en.pdf; Lead Free: Yes; Category: UNK; Mouser Description: Wi-Fi/BT BLE Module ESP32-D0WD, SPI Flash, UART, P; Device Class L1: Integrated Circuits (ICs); RoHS: TRUE; Temperature Range Low: -40°C; ComponentLink2Description: Datasheet; Digikey Description: WIFI MODULE 32MBITS SPI FLASH; Height: 3.2mm; Temperature: -40°C to +85°C; Manufacturer Part Number: ESP32-WROOM-32D; Device Class L3: Transceivers; Device Class L2: RF Semiconductors and Devices; Temperature Range High: +85°C; Automotive: No
ESP32_BOOT ESP32_RESET ESP32_SLEEP = CMP-2100-03586-2: SWITCH TACTILE SPST-NO 0.05A 12V; Contact Resistance: 100mR; Operating Force: 1.5N; Max Current Rating: 50mA; Switch Travel: 0.15mm; Actuator Type: Standard; Mechanical Life: 200000Cycles; Ratings: Dust Proof; Illumination Type: Non-Illuminated; Throw Configuration: SPST; Actuator Length: 0.4mm; Switch Function: Off-Mom; Height: 1.2mm; Width: 3mm; Weight: 0.000776oz; Contact Material: Silver; Max Voltage Rating (DC): 12V; Insulation Resistance: 100MR; Lead Free: Lead Free; Current Rating: 50mA; Termination: SMD/SMT; Length: 4mm; Voltage Rating (DC): 12V; Contact Current Rating: 50mA; Orientation: Straight; Depth: 2.5mm; Max Operating Temperature: 70°C; Packaging: Tape and Reel; Min Operating Temperature: -25°C; Package Quantity: 1; Mount: Surface Mount; Electrical Life: 200000Cycles
R12 R13 R27 R47 = CMP-2001-00590-1: as R1 on sheet USB-ESP32
R33 = CMP-2100-03669-1: Chip Resistor, 100 Ohm, +/-1%, 0.125 W, -55 to 155 degC, 0805 (2012 Metric), RoHS, Tape and Reel; Manufacturer: Yageo; Power Rating: 125mW; Resistance: 100Ohm; Voltage Rating: 150V; Tolerance: 1%; Temperature Coefficient: 100ppm/degreesC; Length: 2mm; Package Description: 2-Pin Surface Mounted Device, Body 2 x 1.25 mm; Case Code (Imperial): 0805; Number of Pins: 2; Termination: SMD/SMT; Lead Pitch: 0.4mm; Package Quantity: 1; Height: 0.024inch; Case Code (Metric): 2012; Number of Terminations: 2; Datasheet Version: Rev. 5, 10/2016; Lead Free: LeadFree; Package Reference: 0805; Composition: ThickFilm; REACH SVHC: Unknown; Voltage Rating (DC): 150V; Min Operating Temperature: -55degC; Packaging: TapeandReel; Military Standard: Not; Case/Package: 0805; Datasheet URL: http://www.yageo.com/NewPortal/yageodocoutput?fileName=/pdf/R-Chip/PYu-RC_Group_51_RoHS_L_5.pdf; Max Operating Temperature: 155degC; Manufacturer URL: http://www.yageo.com/; Max Power Dissipation: 125mW; Width: 0.049inch; Depth: 1.25mm; RoHSCompliant: true
R48 = CMP-1013-00655-1: 20K 0.125W 1% 0805 (2012 Metric)  SMD; Case-EIA: 0805; Case-Metric: 2012; Value: 20000.00 Ohm; Power: 0.125 W; Tolerance: 1 %; Technology: SMT

## Sheet GPIO_EXT.SchDoc
size B
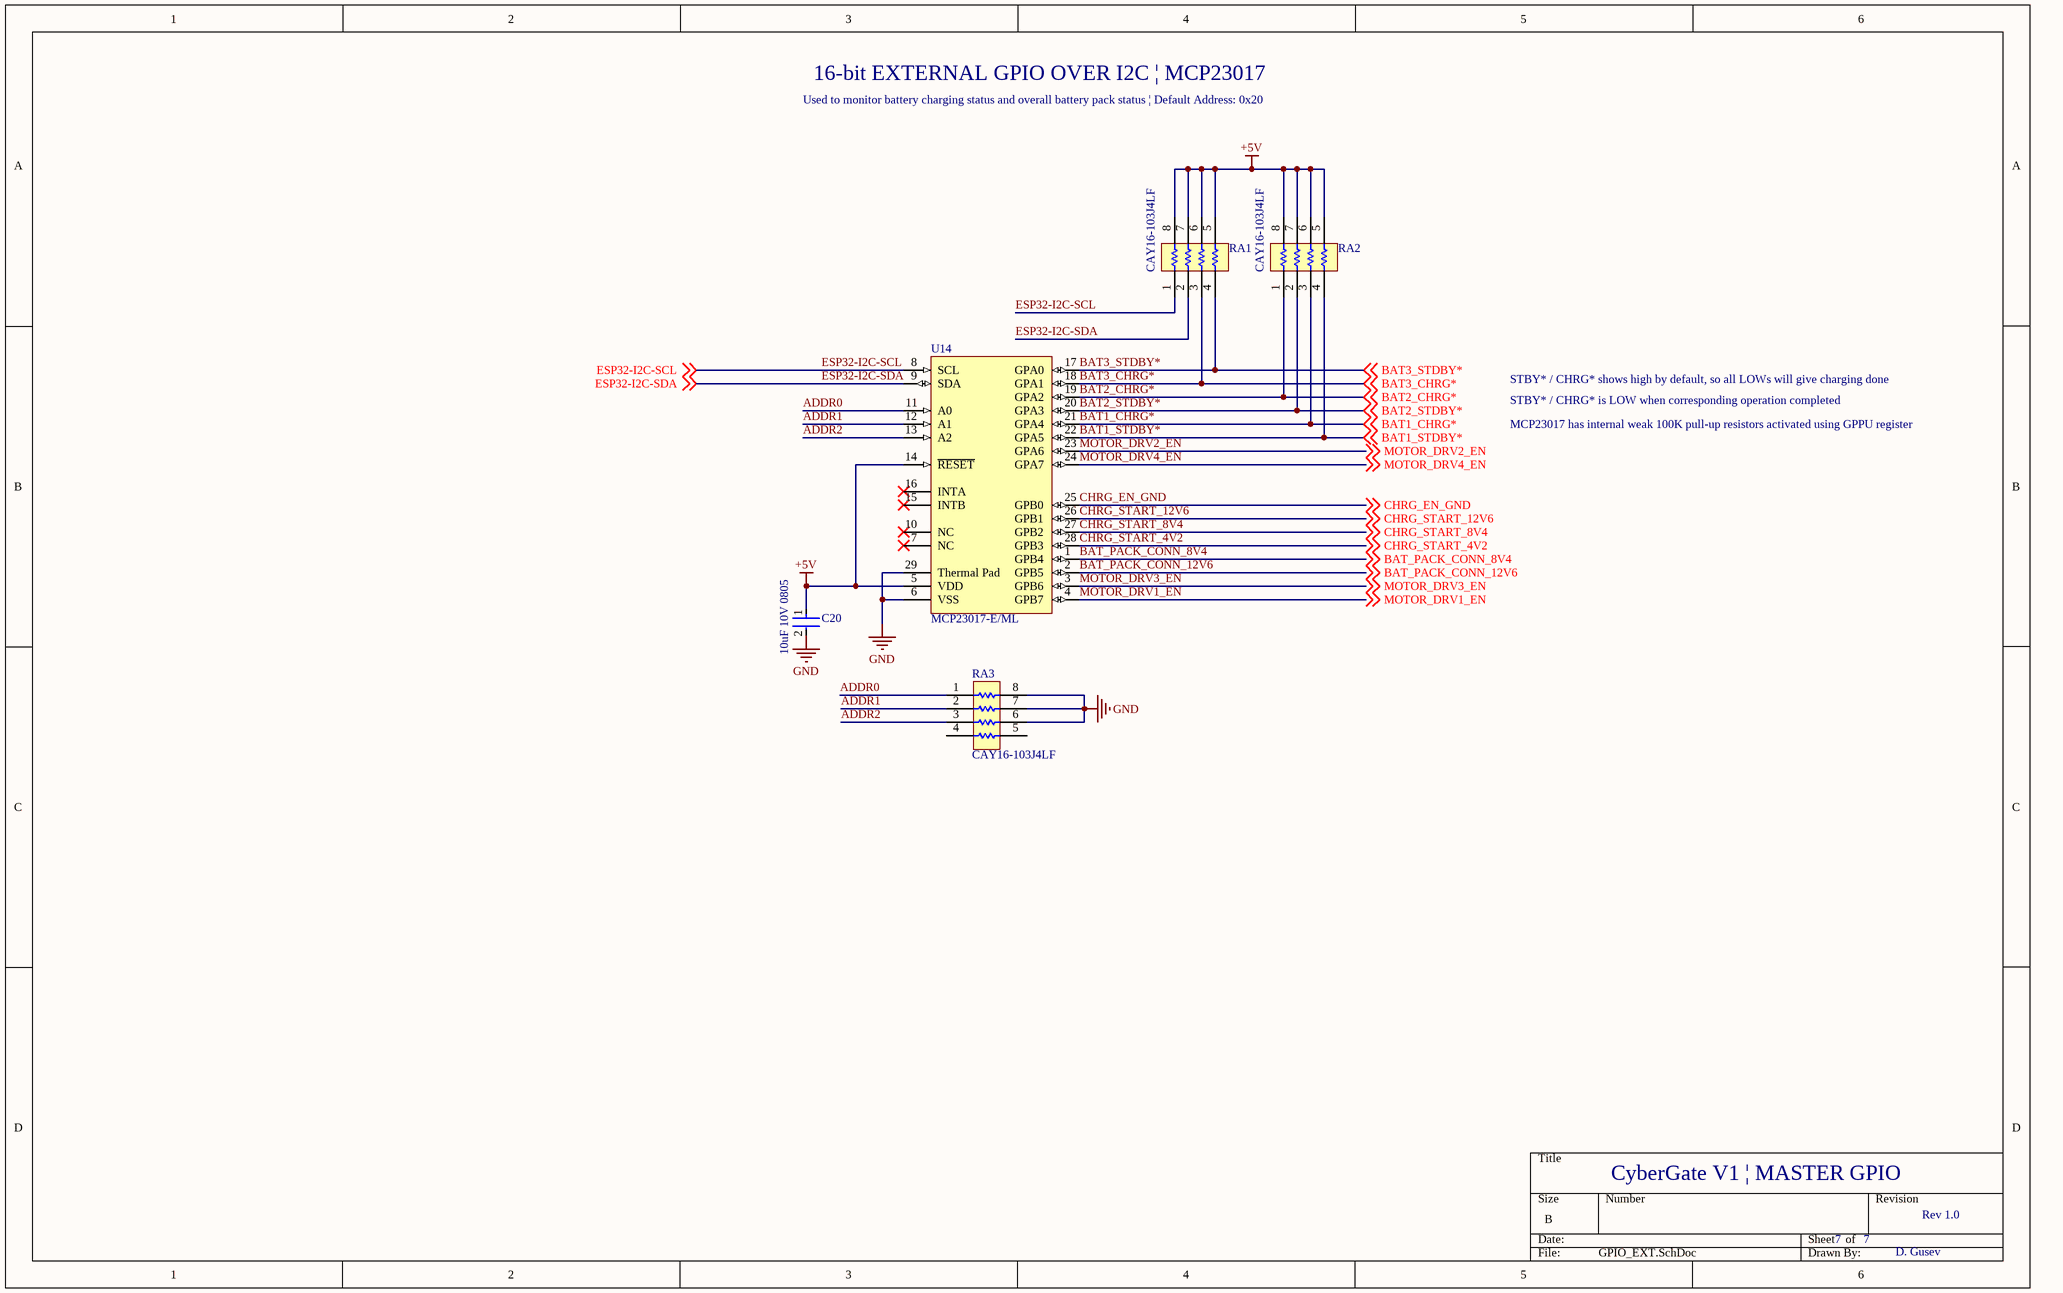
[diagram p2: GPIO_EXT.SchDoc]

### Parts
C20  10uF 10V 0805  [FP-C0805C-DG-MFG]
RA1  CAY16-103J4LF  [BOUR-CAY16-J4_V]
RA2  CAY16-103J4LF  [BOUR-CAY16-J4_V]
RA3  CAY16-103J4LF  [BOUR-CAY16-J4_V]
U14  MCP23017-E/ML  [MCP23017]

### Nets
+5V: C20.1 RA1.5 RA1.6 RA1.7 RA1.8 RA2.5 RA2.6 RA2.7 RA2.8 U14.5(VDD) U14.14(~{RESET})
GND: C20.2 RA3.6 RA3.7 RA3.8 U14.6(VSS) U14.29(Thermal_Pad)
ADDR0: RA3.1 U14.11(A0)
ADDR1: RA3.2 U14.12(A1)
ADDR2: RA3.3 U14.13(A2)
BAT1_CHRG*: RA2.3 U14.21(GPA4) ; off-sheet BAT1_CHRG*
BAT1_STDBY*: RA2.4 U14.22(GPA5) ; off-sheet BAT1_STDBY*
BAT2_CHRG*: RA2.1 U14.19(GPA2) ; off-sheet BAT2_CHRG*
BAT2_STDBY*: RA2.2 U14.20(GPA3) ; off-sheet BAT2_STDBY*
BAT3_CHRG*: RA1.3 U14.18(GPA1) ; off-sheet BAT3_CHRG*
BAT3_STDBY*: RA1.4 U14.17(GPA0) ; off-sheet BAT3_STDBY*
BAT_PACK_CONN_8V4: U14.1(GPB4) ; off-sheet BAT_PACK_CONN_8V4
BAT_PACK_CONN_12V6: U14.2(GPB5) ; off-sheet BAT_PACK_CONN_12V6
CHRG_EN_GND: U14.25(GPB0) ; off-sheet CHRG_EN_GND
CHRG_START_4V2: U14.28(GPB3) ; off-sheet CHRG_START_4V2
CHRG_START_8V4: U14.27(GPB2) ; off-sheet CHRG_START_8V4
CHRG_START_12V6: U14.26(GPB1) ; off-sheet CHRG_START_12V6
ESP32-I2C-SCL: RA1.1 U14.8(SCL) ; off-sheet ESP32-I2C-SCL
ESP32-I2C-SDA: RA1.2 U14.9(SDA) ; off-sheet ESP32-I2C-SDA
MOTOR_DRV1_EN: U14.4(GPB7) ; off-sheet MOTOR_DRV1_EN
MOTOR_DRV2_EN: U14.23(GPA6) ; off-sheet MOTOR_DRV2_EN
MOTOR_DRV3_EN: U14.3(GPB6) ; off-sheet MOTOR_DRV3_EN
MOTOR_DRV4_EN: U14.24(GPA7) ; off-sheet MOTOR_DRV4_EN

Not connected (* = marked no-connect by the designer): RA3 4 5; U14 7(NC)* 10(NC)* 15(INTB)* 16(INTA)*

### Notes on the sheet
- 16-bit EXTERNAL GPIO OVER I2C | MCP23017
- Used to monitor battery charging status and overall battery pack status | Default Address: 0x20
- STBY* / CHRG* shows high by default, so all LOWs will give charging done
- STBY* / CHRG* is LOW when corresponding operation completed
- MCP23017 has internal weak 100K pull-up resistors activated using GPPU register
- CyberGate V1 | MASTER GPIO
- 7
- Rev 1.0
- D. Gusev

### Library data of the parts
C20 = CMP-2007-03243-2: as C7 on sheet ESP32; Device Class L2: Capacitors; Device Class L1: Passive Components; ComponentLink2URL: https://content.kemet.com/datasheets/KEM_C1006_X5R_SMD.pdf; Height: 1.4mm; Lead Free: Yes; Digikey Description: CAP CER 10UF 10V X5R 0805; Octopart: https://octopart.com/c0805c106k8pactu-kemet-98697; Capacitance: 10uF; Value: 10uF; Temperature Range Low: -55°C; Temperature: -55°C to +85°C; Automotive: No; Mouser Description: CAP CER 10UF 10V X5R 0805; Ipc Land Pattern Name: CAPC200125X125; Temperature Range High: +85°C; Voltage: 10V; RoHS: TRUE; Device Class L3: Ceramic Capacitors; ComponentLink2Description: Datasheet; Voltage Rating: 10V; Package: C0805C-DG; Temperature Characteristic: X5R; Category: Cap
RA1-RA3 = CMP-1747-00005-1: Chip Resistor Array, 10 KOhm, +/- 5%, 62.5 mW, -55 to 125 degC, 8-Pin SMD, RoHS, Tape and Reel; Power Rating: 100 mW; Case\Package: 0603; Voltage Rating: 75 V; Tolerance: 1%; Resistance: 220 Ohm; Packaging: Tape and Reel; Min Operating Temperature: -55 degC; Pins: 2; Radiation Hardening: No; DatasheetVersion: Jan-15; Length: 0.063 inch; RoHSCompliant: true; Mount: Surface Mount; ComponentLink1Description: Manufacturer URL; ComponentLink1URL: http://www.bourns.com/; Weight: 7.1E-05 oz; ComponentLink2URL: http://www.bourns.com/docs/Product-Datasheets/CATCAY.pdf; PackageReference: CAY16-J4; Width: 0.031 inch; Case Code (Imperial): 0603; Case Code (Metric): 1608; REACH SVHC: Yes; Max Operating Temperature: 155 degC; ComponentLink2Description: Datasheet; Height: 0.022 inch; PackageDescription: 8-Pin Surface Mount Device, Body 1.6 x 3.2 mm, Pitch 0.8 mm
U14 = MCP23017: 16-Bit I/O Expander with Serial Interface, 28-Pin QFN, Extended Temperature; ComponentLink1URL: http://www.microchip.com/; ComponentLink3Description: Package Specification; PackageReference: QFN-ML28; PackageVersion: revBB, Aug-2009; PackageDescription: 28-Lead Plastic Quad Flat, No Lead Package (ML) - 6x6 mm Body [QFN] with 0.55 mm Contact Length; DatasheetVersion: revB, Feb-2007; ComponentLink1Description: Manufacturer URL; RevisionNote: URLs added.; ComponentLink2Description: Datasheet; Code_JEDEC: MO-220; ComponentLink3URL: http://www.microchip.com/stellent/groups/techpub_sg/documents/packagingspec/en012702.pdf; ComponentLink2URL: http://ww1.microchip.com/downloads/en/DeviceDoc/21952b.pdf

## Sheet DRV8833.SchDoc
size B
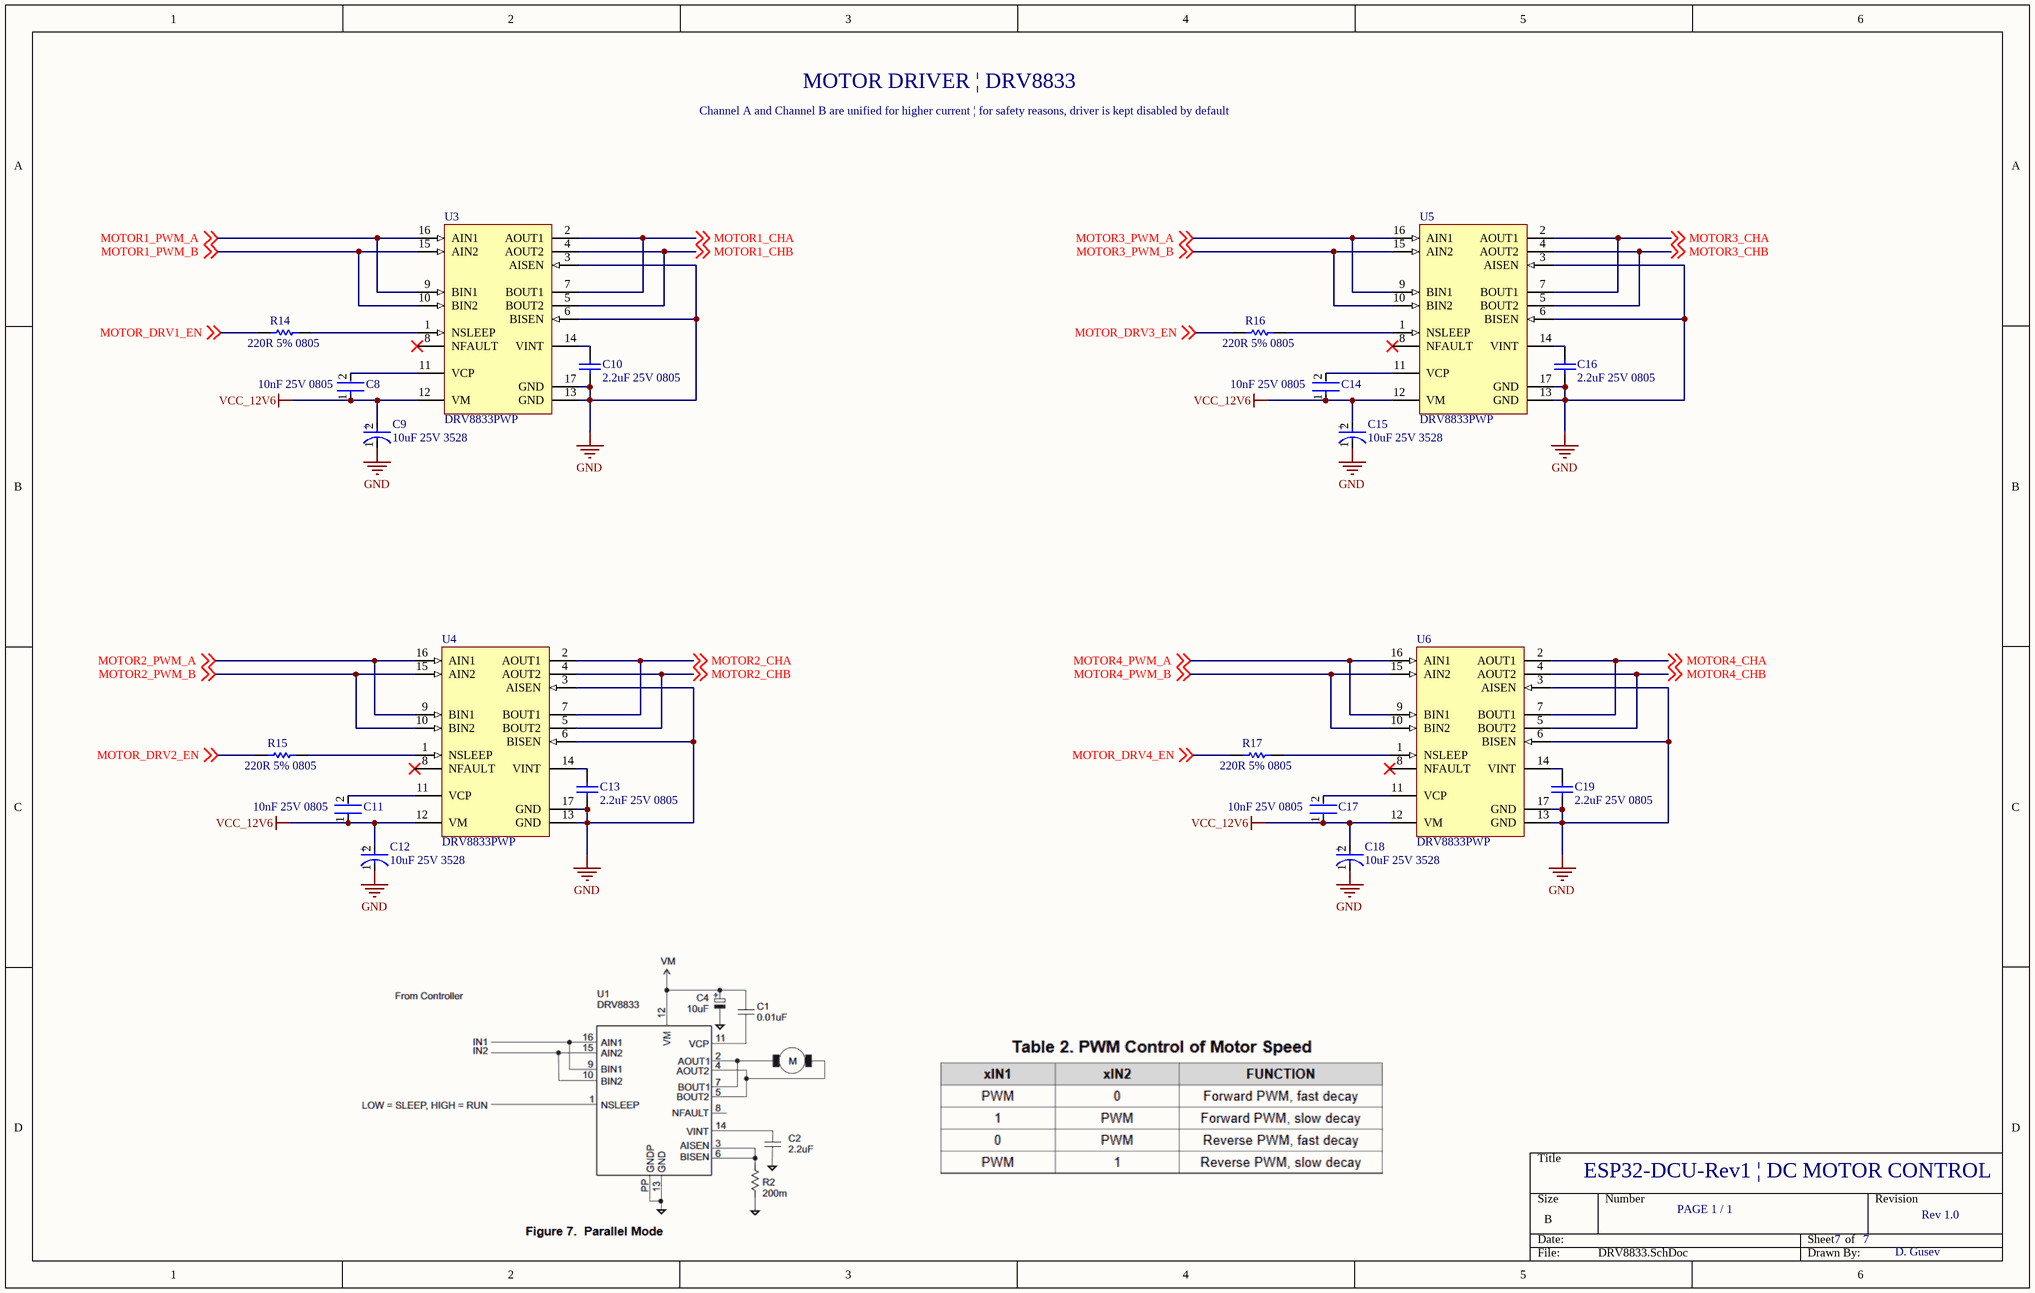
[diagram p3: DRV8833.SchDoc]

### Parts
C8  10nF 25V 0805  [FP-C0805C-DN-MFG]
C9  10uF 25V 3528  [FP-T491B106K025AT-MFG]
C10  2.2uF 25V 0805  [CAPC2013X135X45ML10T25]
C11  10nF 25V 0805  [FP-C0805C-DN-MFG]
C12  10uF 25V 3528  [FP-T491B106K025AT-MFG]
C13  2.2uF 25V 0805  [CAPC2013X135X45ML10T25]
C14  10nF 25V 0805  [FP-C0805C-DN-MFG]
C15  10uF 25V 3528  [FP-T491B106K025AT-MFG]
C16  2.2uF 25V 0805  [CAPC2013X135X45ML10T25]
C17  10nF 25V 0805  [FP-C0805C-DN-MFG]
C18  10uF 25V 3528  [FP-T491B106K025AT-MFG]
C19  2.2uF 25V 0805  [CAPC2013X135X45ML10T25]
R14  220R 5% 0805  [RESC2013X60X40NL20T25]
R15  220R 5% 0805  [RESC2013X60X40NL20T25]
R16  220R 5% 0805  [RESC2013X60X40NL20T25]
R17  220R 5% 0805  [RESC2013X60X40NL20T25]
U3  DRV8833PWP  [PWP0016C_N]
U4  DRV8833PWP  [PWP0016C_N]
U5  DRV8833PWP  [PWP0016C_N]
U6  DRV8833PWP  [PWP0016C_N]

### Nets
GND: C9.1(C) C10.1 C12.1(C) C13.1 C15.1(C) C16.1 C18.1(C) C19.1 U3.3(AISEN) U3.6(BISEN) U3.13(GND) U3.17(GND) U4.3(AISEN) U4.6(BISEN) U4.13(GND) U4.17(GND) U5.3(AISEN) U5.6(BISEN) U5.13(GND) U5.17(GND) U6.3(AISEN) U6.6(BISEN) U6.13(GND) U6.17(GND)
VCC_12V6: C8.1 C9.2(A) C11.1 C12.2(A) C14.1 C15.2(A) C17.1 C18.2(A) U3.12(VM) U4.12(VM) U5.12(VM) U6.12(VM)
MOTOR1_CHA: U3.2(AOUT1) U3.7(BOUT1) ; off-sheet MOTOR1_CHA
MOTOR1_CHB: U3.4(AOUT2) U3.5(BOUT2) ; off-sheet MOTOR1_CHB
MOTOR1_PWM_A: U3.9(BIN1) U3.16(AIN1) ; off-sheet MOTOR1_PWM_A
MOTOR1_PWM_B: U3.10(BIN2) U3.15(AIN2) ; off-sheet MOTOR1_PWM_B
MOTOR2_CHA: U4.2(AOUT1) U4.7(BOUT1) ; off-sheet MOTOR2_CHA
MOTOR2_CHB: U4.4(AOUT2) U4.5(BOUT2) ; off-sheet MOTOR2_CHB
MOTOR2_PWM_A: U4.9(BIN1) U4.16(AIN1) ; off-sheet MOTOR2_PWM_A
MOTOR2_PWM_B: U4.10(BIN2) U4.15(AIN2) ; off-sheet MOTOR2_PWM_B
MOTOR3_CHA: U5.2(AOUT1) U5.7(BOUT1) ; off-sheet MOTOR3_CHA
MOTOR3_CHB: U5.4(AOUT2) U5.5(BOUT2) ; off-sheet MOTOR3_CHB
MOTOR3_PWM_A: U5.9(BIN1) U5.16(AIN1) ; off-sheet MOTOR3_PWM_A
MOTOR3_PWM_B: U5.10(BIN2) U5.15(AIN2) ; off-sheet MOTOR3_PWM_B
MOTOR4_CHA: U6.2(AOUT1) U6.7(BOUT1) ; off-sheet MOTOR4_CHA
MOTOR4_CHB: U6.4(AOUT2) U6.5(BOUT2) ; off-sheet MOTOR4_CHB
MOTOR4_PWM_A: U6.9(BIN1) U6.16(AIN1) ; off-sheet MOTOR4_PWM_A
MOTOR4_PWM_B: U6.10(BIN2) U6.15(AIN2) ; off-sheet MOTOR4_PWM_B
MOTOR_DRV1_EN: R14.1 ; off-sheet MOTOR_DRV1_EN
MOTOR_DRV2_EN: R15.1 ; off-sheet MOTOR_DRV2_EN
MOTOR_DRV3_EN: R16.1 ; off-sheet MOTOR_DRV3_EN
MOTOR_DRV4_EN: R17.1 ; off-sheet MOTOR_DRV4_EN
NetC8_2: C8.2 U3.11(VCP)
NetC10_2: C10.2 U3.14(VINT)
NetC11_2: C11.2 U4.11(VCP)
NetC13_2: C13.2 U4.14(VINT)
NetC14_2: C14.2 U5.11(VCP)
NetC16_2: C16.2 U5.14(VINT)
NetC17_2: C17.2 U6.11(VCP)
NetC19_2: C19.2 U6.14(VINT)
NetR14_2: R14.2 U3.1(NSLEEP)
NetR15_2: R15.2 U4.1(NSLEEP)
NetR16_2: R16.2 U5.1(NSLEEP)
NetR17_2: R17.2 U6.1(NSLEEP)

Not connected (* = marked no-connect by the designer): U3 8(NFAULT)*; U4 8(NFAULT)*; U5 8(NFAULT)*; U6 8(NFAULT)*

### Notes on the sheet
- MOTOR DRIVER | DRV8833
- Channel A and Channel B are unified for higher current | for safety reasons, driver is kept disabled by default
- ESP32-DCU-Rev1 | DC MOTOR CONTROL
- PAGE 1 / 1
- 7
- Rev 1.0
- D. Gusev
- (in symbol CMP-03017-000036-1) +

### Library data of the parts
C8 C11 C14 C17 = CMP-2007-00493-2: CAP CER 10000PF 25V 5% NP0 0805; Manufacturer: KEMET; Manufacturer Part Number: C0805C103J3GACTU; Capacitance: 10,000 pF; Tolerance: 0.05; Value: 10,000 pF; Material: Ceramic; Temperature Characteristic: C0G; Temperature Coefficient: 30ppm/°C; Octopart: https://octopart.com/c0805c103j3gactu-kemet-12563663; Lead Free: Yes; RoHS: TRUE; Package: C0805C-DN; Voltage Rating: 25 V; Ipc Land Pattern Name: CAPC200125X78; ComponentLink2URL: https://content.kemet.com/datasheets/KEM_C1003_C0G_SMD.pdf; Device Class L1: Passive Components; Category: Cap; ComponentLink2Description: Datasheet; Temperature Range High: +125°C; Height: 0.88mm; Temperature Range Low: -55°C; Device Class L3: Ceramic Capacitors; Digikey Description: CAP CER 10000PF 25V 5% NP0 0805; Device Class L2: Capacitors; Mouser Description: Multilayer Ceramic Capacitors MLCC - SMD/SMT 25volts 10000pF 5% C0G; Temperature: -55°C to +125°C; Automotive: No
C9 C12 C15 C18 = CMP-03017-000036-1: CAP TANT 10UF 10% 25V 1411; Life (Hours): 2000Hour; Leakage Current: 2.5uA; ESR (Equivalent Series Resistance): 3R; Ripple Current: 168mA; Polarity: Polar; Dielectric Material: Tantalum; Dissipation Factor: 8%; Package Quantity: 1; Series: T491; Features: General Purpose; Lead Free: Lead Free; Termination: SMD/SMT; Packaging: Tape and Reel; Max Operating Temperature: 125°C; Number of Pins: 2; Case Code (Imperial): 1411; Height - Seated (Max): 0.083inch; Min Operating Temperature: -55°C; Case/Package: 1411; Voltage: 25V; Tolerance: 10%; REACH SVHC: No SVHC; Case Code (Metric): 3528; Depth: 2.8mm; Mount: Surface Mount; Voltage Rating (DC): 25V; Length: 3.5mm; Voltage Rating: 25V; Capacitance: 10uF; Construction: Flat; RoHS Compliant: Yes; Height: 1.9mm; Width: 0.11inch; Radiation Hardening: No
C10 C13 C16 C19 = CMP-2007-03522-1: Part Number: GRM21BF51E225ZA01L; Manufacturer: Murata
R14-R17 = CMP-2001-00612-1: Manufacturer: Panasonic; Part Number: ERA6AEB221V
U3-U6 = CMP-1529-00003-2: 2 A Low Voltage Dual Brushed DC or Single Bipolar Stepper Motor Driver (PWM Ctrl), 2.7 to 10.8 V, -40 to 85 degC, 16-Pin SOP (PWP), Green (RoHS & no Sb/Br), Tube; Manufacturer: Texas Instruments; Peak Output Current: 2 A; Vs: 2.7 V Min.; rDS (ON) (LS + HS): 360 mOhms; RMS Output Current: 1.5 A; ComponentLink2Description: Datasheet; DatasheetVersion: SLVSAR1D; PackageDescription: 16-Pin Plastic Small Outline, Body 4.4 x 5 mm, Pitch 0.65 mm; Control I/F: PWM; Package Reference: PWP0016C; ComponentLink3URL: http://www.ti.com/lit/ml/mpds371/mpds371.pdf; PartNumber: DRV8833PWP; PackageVersion: 4073225-3/I; ComponentLink1Description: Manufacturer URL; ComponentLink2URL: http://www.ti.com/lit/ds/symlink/drv8833.pdf; Packing: Tube; Mounting Technology: Surface Mount; Temperature Range: -40 to 85 degC; ComponentLink1URL: www.ti.com; ComponentLink3Description: Package Specification; Eco-Plan: Green (RoHS & no Sb/Br)

## Sheet CONN.SchDoc
size B
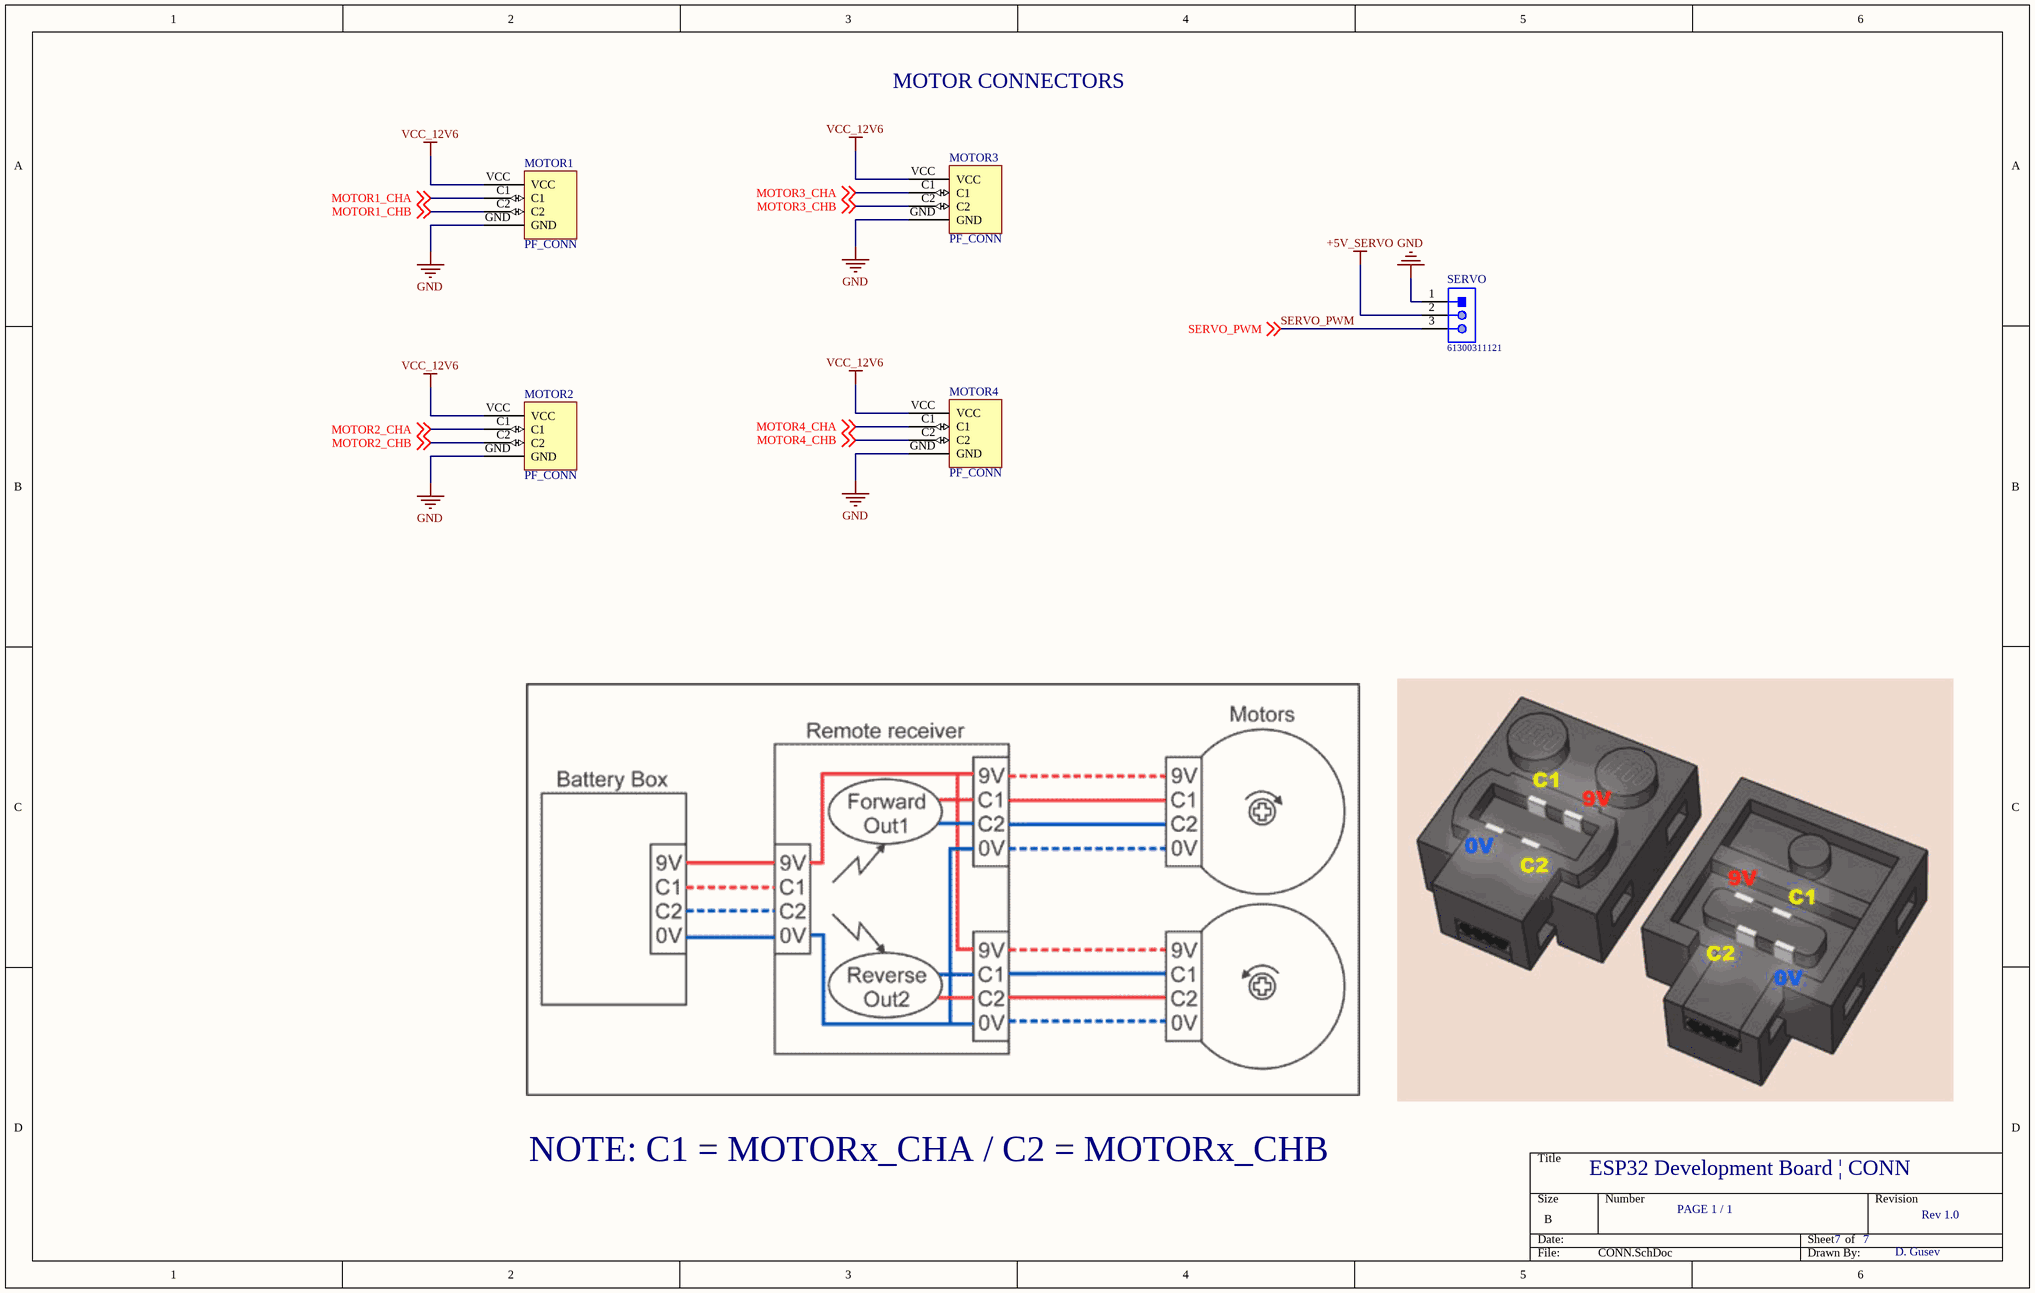
[diagram p4: CONN.SchDoc]

### Parts
MOTOR1  PF_CONN  [PF_CONN]
MOTOR2  PF_CONN  [PF_CONN]
MOTOR3  PF_CONN  [PF_CONN]
MOTOR4  PF_CONN  [PF_CONN]
SERVO  61300311121  [61300311121]

### Nets
+5V_SERVO: SERVO.2
GND: MOTOR1.GND MOTOR2.GND MOTOR3.GND MOTOR4.GND SERVO.1
VCC_12V6: MOTOR1.VCC MOTOR2.VCC MOTOR3.VCC MOTOR4.VCC
MOTOR1_CHA: MOTOR1.C1 ; off-sheet MOTOR1_CHA
MOTOR1_CHB: MOTOR1.C2 ; off-sheet MOTOR1_CHB
MOTOR2_CHA: MOTOR2.C1 ; off-sheet MOTOR2_CHA
MOTOR2_CHB: MOTOR2.C2 ; off-sheet MOTOR2_CHB
MOTOR3_CHA: MOTOR3.C1 ; off-sheet MOTOR3_CHA
MOTOR3_CHB: MOTOR3.C2 ; off-sheet MOTOR3_CHB
MOTOR4_CHA: MOTOR4.C1 ; off-sheet MOTOR4_CHA
MOTOR4_CHB: MOTOR4.C2 ; off-sheet MOTOR4_CHB
SERVO_PWM: SERVO.3 ; off-sheet SERVO_PWM

### Notes on the sheet
- MOTOR CONNECTORS
- NOTE: C1 = MOTORx_CHA / C2 = MOTORx_CHB
- ESP32 Development Board | CONN
- PAGE 1 / 1
- 7
- Rev 1.0
- D. Gusev

### Library data of the parts
SERVO = CMP-1502-01062-1: THT Vertical Pin Header WR-PHD, Pitch 2.54 mm, Single Row, 3 pins; Manufacturer: Wurth Elektronik; Withstanding Voltage: 500VAC; Working Voltage: 250VAC; Rated Current: 3A; Pitch: 2.54mm; Pin Number: 3; Gender: Male; Contact Resistance: 20mOhm; Package Reference: 61300311121; Manufacturer URL: http://www.we-online.de; Datasheet URL: https://katalog.we-online.de/em/datasheet/6130xx11121.pdf; Operating Temperature: -40to105degC; Part Number: 61300311121; Orientation: Vertical; Packaging: Bag; Row Number: Single; Mounting Technology: THT; Publisher: WurthElektronik

## Sheet CHARGING.SchDoc
size B
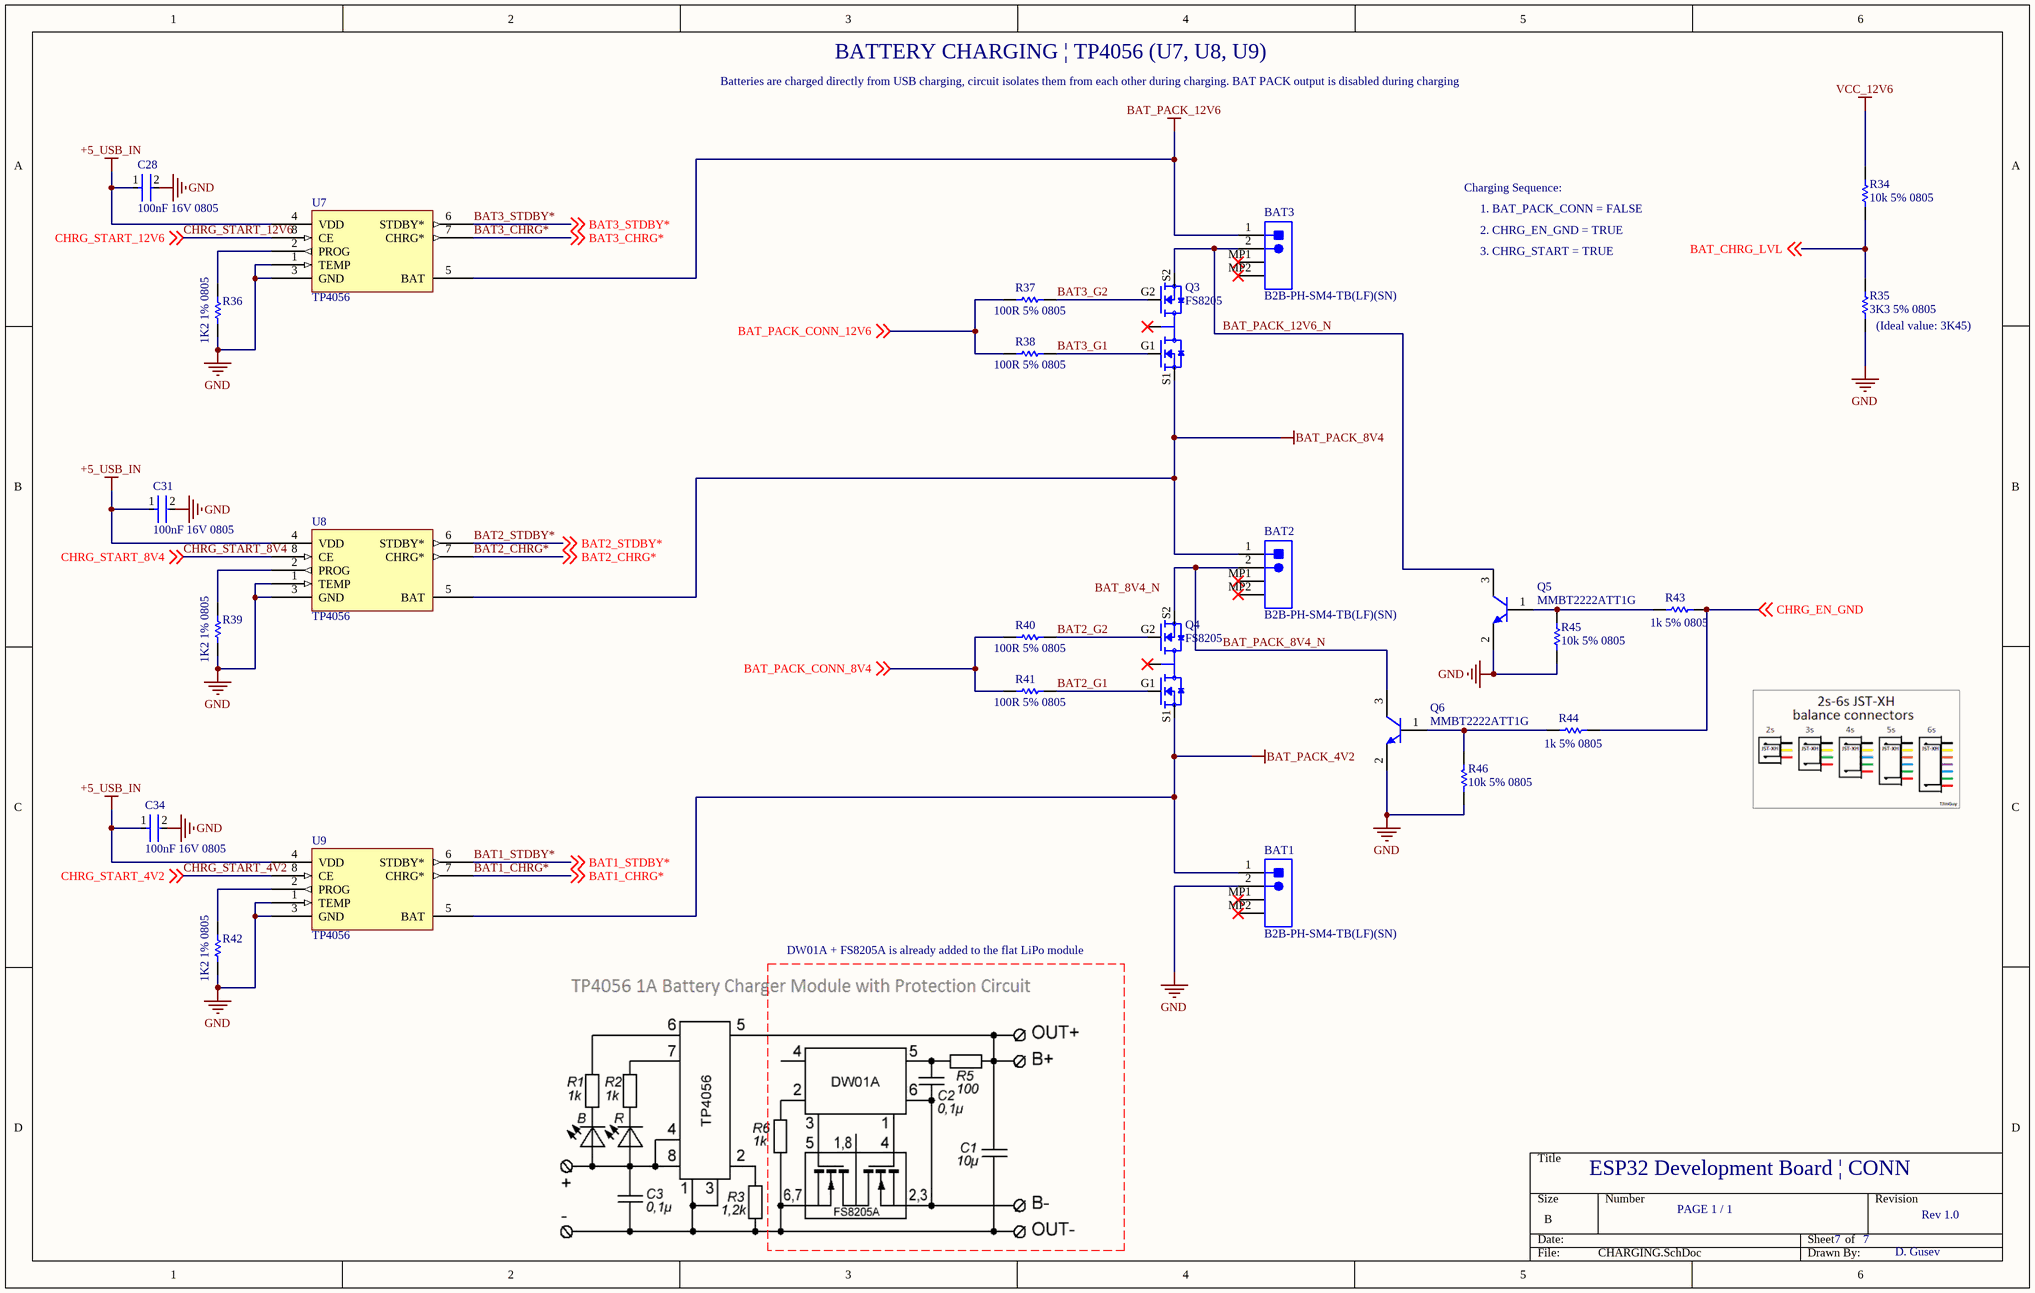
[diagram p5: CHARGING.SchDoc]

### Parts
BAT1  B2B-PH-SM4-TB(LF)(SN)  [JST-B2B-PH-SM4-TB-2_V]
BAT2  B2B-PH-SM4-TB(LF)(SN)  [JST-B2B-PH-SM4-TB-2_V]
BAT3  B2B-PH-SM4-TB(LF)(SN)  [JST-B2B-PH-SM4-TB-2_V]
C28  100nF 16V 0805  [FP-C0805C-DN-MFG]
C31  100nF 16V 0805  [FP-C0805C-DN-MFG]
C34  100nF 16V 0805  [FP-C0805C-DN-MFG]
Q3  FS8205  [FS8205]
Q4  FS8205  [FS8205]
Q5  MMBT2222ATT1G  [ONSC-SC-75-3-463-01_V]
Q6  MMBT2222ATT1G  [ONSC-SC-75-3-463-01_V]
R34  10k 5% 0805  [RESC2013X60X35NL10T20]
R35  3K3 5% 0805  [RESC2013X60X35ML10T20]
R36  1K2 1% 0805  [RESC2013X70X40ML20T20]
R37  100R 5% 0805  [RESC2013X60X35ML10T20]
R38  100R 5% 0805  [RESC2013X60X35ML10T20]
R39  1K2 1% 0805  [RESC2013X70X40ML20T20]
R40  100R 5% 0805  [RESC2013X60X35ML10T20]
R41  100R 5% 0805  [RESC2013X60X35ML10T20]
R42  1K2 1% 0805  [RESC2013X70X40ML20T20]
R43  1k 5% 0805  [RESC2013X60X35ML10T20]
R44  1k 5% 0805  [RESC2013X60X35ML10T20]
R45  10k 5% 0805  [RESC2013X60X35NL10T20]
R46  10k 5% 0805  [RESC2013X60X35NL10T20]
U7  TP4056  [TP4056]
U8  TP4056  [TP4056]
U9  TP4056  [TP4056]

### Nets
+5_USB_IN: C28.1 C31.1 C34.1 U7.4(VDD) U8.4(VDD) U9.4(VDD)
BAT_PACK_4V2: BAT1.1 Q4.S1 U9.5(BAT)
BAT_PACK_8V4: BAT2.1 Q3.S1 U8.5(BAT)
BAT_PACK_12V6: BAT3.1 U7.5(BAT)
GND: BAT1.2 C28.2 C31.2 C34.2 Q5.2(E) Q6.2(E) R35.1 R36.1 R39.1 R42.1 R45.1 R46.2 U7.1(TEMP) U7.3(GND) U8.1(TEMP) U8.3(GND) U9.1(TEMP) U9.3(GND)
VCC_12V6: R34.2
BAT1_CHRG*: U9.7(CHRG*) ; off-sheet BAT1_CHRG*
BAT1_STDBY*: U9.6(STDBY*) ; off-sheet BAT1_STDBY*
BAT2_CHRG*: U8.7(CHRG*) ; off-sheet BAT2_CHRG*
BAT2_G1: Q4.G1 R41.2
BAT2_G2: Q4.G2 R40.2
BAT2_STDBY*: U8.6(STDBY*) ; off-sheet BAT2_STDBY*
BAT3_CHRG*: U7.7(CHRG*) ; off-sheet BAT3_CHRG*
BAT3_G1: Q3.G1 R38.2
BAT3_G2: Q3.G2 R37.2
BAT3_STDBY*: U7.6(STDBY*) ; off-sheet BAT3_STDBY*
BAT_CHRG_LVL: R34.1 R35.2 ; off-sheet BAT_CHRG_LVL
BAT_PACK_8V4_N: BAT2.2 Q4.S2 Q6.3(C)
BAT_PACK_12V6_N: BAT3.2 Q3.S2 Q5.3(C)
BAT_PACK_CONN_8V4: R40.1 R41.1 ; off-sheet BAT_PACK_CONN_8V4
BAT_PACK_CONN_12V6: R37.1 R38.1 ; off-sheet BAT_PACK_CONN_12V6
CHRG_EN_GND: R43.2 R44.2 ; off-sheet CHRG_EN_GND
CHRG_START_4V2: U9.8(CE) ; off-sheet CHRG_START_4V2
CHRG_START_8V4: U8.8(CE) ; off-sheet CHRG_START_8V4
CHRG_START_12V6: U7.8(CE) ; off-sheet CHRG_START_12V6
NetQ5_1: Q5.1(B) R43.1 R45.2
NetQ6_1: Q6.1(B) R44.1 R46.1
NetR36_2: R36.2 U7.2(PROG)
NetR39_2: R39.2 U8.2(PROG)
NetR42_2: R42.2 U9.2(PROG)

Not connected (* = marked no-connect by the designer): BAT1 MP1* MP2*; BAT2 MP1* MP2*; BAT3 MP1* MP2*; Q3 D12*; Q4 D12*

### Notes on the sheet
- Batteries are charged directly from USB charging, circuit isolates them from each other during charging. BAT PACK output is disabled during charging
- BATTERY CHARGING | TP4056 (U7, U8, U9)
- Charging Sequence:
- 1. BAT_PACK_CONN = FALSE
- 2. CHRG_EN_GND = TRUE
- 3. CHRG_START = TRUE
- (near R35) (Ideal value: 3K45)
- DW01A + FS8205A is already added to the flat LiPo module
- ESP32 Development Board | CONN
- PAGE 1 / 1
- 7
- Rev 1.0
- D. Gusev
- Labels drawn without touching a wire or pin: BAT_8V4_N

### Library data of the parts
BAT1-BAT3 = CMP-2000-05163-1: Male Header, Pitch 2 mm, 1 x 2 Position, Height 6.6 mm, RoHS, Tape and Reel; Manufacturer: JST; No of Positions: 2; Style/Orientation: StraightHeader/Plug; Pitch: 2mm; Datasheet URL: https://ciiva.com/datasheet-click-26894756?src=ciiva&sig=90099765; Termination: Crimp; Manufacturer URL: http://www.jst.com/home2.html; Type: ShroudedHeader; Datasheet Version: Dec-12
C28 C31 C34 = CMP-2007-01112-2: CAP CER 0.1UF 16V X7R 0805; Manufacturer Part Number: C0805C104J4RACTU; Manufacturer: KEMET; Value: 0.10 μF; Material: Ceramic; Temperature Coefficient: 30ppm/°C; Tolerance: 0.05; Mouser Description: Multilayer Ceramic Capacitors MLCC - SMD/SMT 16volts 0.1uF X7R 5%; Device Class L2: Capacitors; Temperature: -55°C to +125°C; RoHS: TRUE; Category: Cap; Octopart: https://octopart.com/c0805c104j4ractu-kemet-12563748; Temperature Range Low: -55°C; ComponentLink2URL: https://content.kemet.com/datasheets/KEM_C1003_C0G_SMD.pdf; Ipc Land Pattern Name: CAPC200125X78; Device Class L3: Ceramic Capacitors; Device Class L1: Passive Components; Digikey Description: CAP CER 0.1UF 16V X7R 0805; Temperature Characteristic: X7R; Temperature Range High: +125°C; Package: C0805C-DN; ComponentLink2Description: Datasheet; Capacitance: 0.10 μF; Voltage Rating: 16 V; Height: 0.88mm; Lead Free: Yes; Automotive: No
Q3 Q4 = FS8205: Dual N-Channel Enhancement Mode Power MOSFET; MF: Fortune Semiconductor; Package: Package; MP: FS8205; Value: *; Price: None; SnapEDA_Link: https://www.snapeda.com/parts/FS8205/Fortune%20Semiconductor/view-part/3216395/?ref=snap; Check_prices: https://www.snapeda.com/parts/FS8205/Fortune%20Semiconductor/view-part/3216395/?ref=eda; Availability: In Stock
Q5 Q6 = CMP-1048-00417-1: as Q1 on sheet USB-ESP32; DatasheetVersion: Rev. 5; PackageVersion: Rev. F, 07/2005; ComponentLink1Description: Manufacturer URL; RoHS: TRUE; Packing: Tape and Reel; ComponentLink3URL: http://www.onsemi.com/pub_link/Collateral/463-01.PDF; ComponentLink1URL: http://www.onsemi.com/; ComponentLink3Description: Package Specification; ComponentLink2URL: http://www.onsemi.cn/pub_link/Collateral/MMBT2222ATT1-D.PDF; Mounting Technology: Surface Mount; PartNumber: MMBT2222ATT1G; ComponentLink2Description: Datasheet; Polarity: NPN; PackageReference: SC-75-3-463-01; PackageDescription: 3-Pin Small Outline Transistor, Body 1.6 x 0.8 mm, Pitch 0.5 mm
R34 R45 R46 = CMP-1659-00013-4: Chip Resistor, 10 KOhm, +/- 1%, 0.125 W, -55 to 155 degC, 0805 (2012 Metric), RoHS, Tape and Reel; Manufacturer: Yageo; Voltage Rating: 150 V; Mount: Surface Mount; ComponentLink1Description: Manufacturer URL; ComponentLink2URL: http://www.yageo.com/documents/recent/PYu-RC_Group_51_RoHS_L_04.pdf; Pins: 2; Length: 2 mm; Min Operating Temperature: -55 degC; Height: 0.5 mm; Mounting Technology: Surface Mount; RoHSCompliant: true; REACH SVHC: No SVHC; ComponentLink1URL: http://www.yageo.com/; Max Operating Temperature: 155 degC; PackageReference: 0805; DatasheetVersion: Rev. 4, 02/2016; Package Quantity: 5000; Packaging: Tape and Reel; ComponentLink2Description: Datasheet; PackageDescription: 2-Pin Surface Mounted Device, Body 2 x 1.25 mm
R35 = CMP-1013-00567-2: Chip Resistor, 3.3 KOhm, +/- 1%, 0.125 W, -55 to 155 degC, 0805 (2012 Metric), RoHS, Tape and Reel; Manufacturer: Yageo; Voltage Rating: 150V; Max Power Dissipation: 125mW; Temperature Coefficient: 100ppm/degreesC; Package Quantity: 1; Max Operating Temperature: 155degC; Case Code (Metric): 2012; Package Reference: 0805; Resistance: 3.3KOhm; Composition: ThickFilm; RoHSCompliant: true; Case/Package: 0805; Case Code (Imperial): 0805; Tolerance: 1%; Depth: 1.25mm; Weight: 0.000194oz; Lead Free: LeadFree; Min Operating Temperature: -55degC; Termination: SMD/SMT; Datasheet Version: Rev. 5, 10/2016; REACH SVHC: NoSVHC; Power Rating: 125mW; Packaging: TapeandReel; Number of Terminations: 2; Width: 0.049inch; Package Description: 2-Pin Surface Mounted Device, Body 2 x 1.25 mm; Datasheet URL: http://www.yageo.com/NewPortal/yageodocoutput?fileName=/pdf/R-Chip/PYu-RC_Group_51_RoHS_L_5.pdf; Height: 0.5mm; Length: 2mm; Manufacturer URL: http://www.yageo.com/
R36 R39 R42 = CMP-2001-00512-1: Manufacturer: Panasonic; Part Number: ERJ6ENF1201V
R37 R38 R40 R41 = CMP-2100-03669-1: as R33 on sheet ESP32; Length: 2mm; Package Description: 2-Pin Surface Mounted Device, Body 2 x 1.25 mm; Case Code (Imperial): 0805; Number of Pins: 2; Termination: SMD/SMT; Lead Pitch: 0.4mm; Package Quantity: 1; Height: 0.024inch; Case Code (Metric): 2012; Number of Terminations: 2; Datasheet Version: Rev. 5, 10/2016; Lead Free: LeadFree; Package Reference: 0805; Composition: ThickFilm; REACH SVHC: Unknown; Voltage Rating (DC): 150V; Min Operating Temperature: -55degC; Packaging: TapeandReel; Military Standard: Not; Case/Package: 0805; Datasheet URL: http://www.yageo.com/NewPortal/yageodocoutput?fileName=/pdf/R-Chip/PYu-RC_Group_51_RoHS_L_5.pdf; Max Operating Temperature: 155degC; Manufacturer URL: http://www.yageo.com/; Max Power Dissipation: 125mW; Width: 0.049inch; Depth: 1.25mm; RoHSCompliant: true
R43 R44 = CMP-2100-03671-1: as R3 on sheet USB-ESP32; Number of Pins: 2; Number of Terminations: 2; Datasheet URL: http://www.yageo.com/NewPortal/yageodocoutput?fileName=/pdf/R-Chip/PYu-RC_Group_51_RoHS_L_5.pdf; Length: 0.079inch; Package Description: 2-Pin Surface Mounted Device, Body 2 x 1.25 mm; Depth: 1.25mm; Height: 0.024inch; Military Standard: Not; Case/Package: 0805; Package Reference: 0805; RoHSCompliant: true; Lead Free: LeadFree; Packaging: TapeandReel; Package Quantity: 1; Datasheet Version: Rev. 5, 10/2016; Tolerance: 1%; Min Operating Temperature: -55degC; Voltage Rating: 150V; Composition: ThickFilm; Case Code (Imperial): 0805; Power Rating: 125mW; Width: 0.049inch; Case Code (Metric): 2012; Manufacturer URL: http://www.yageo.com/; Max Operating Temperature: 155degC; REACH SVHC: Unknown; Termination: SMD/SMT
U7-U9 = TP4056: 1-CELL LI+ BATTERY CHARGER

## Sheet POWER_REG.SchDoc
size B
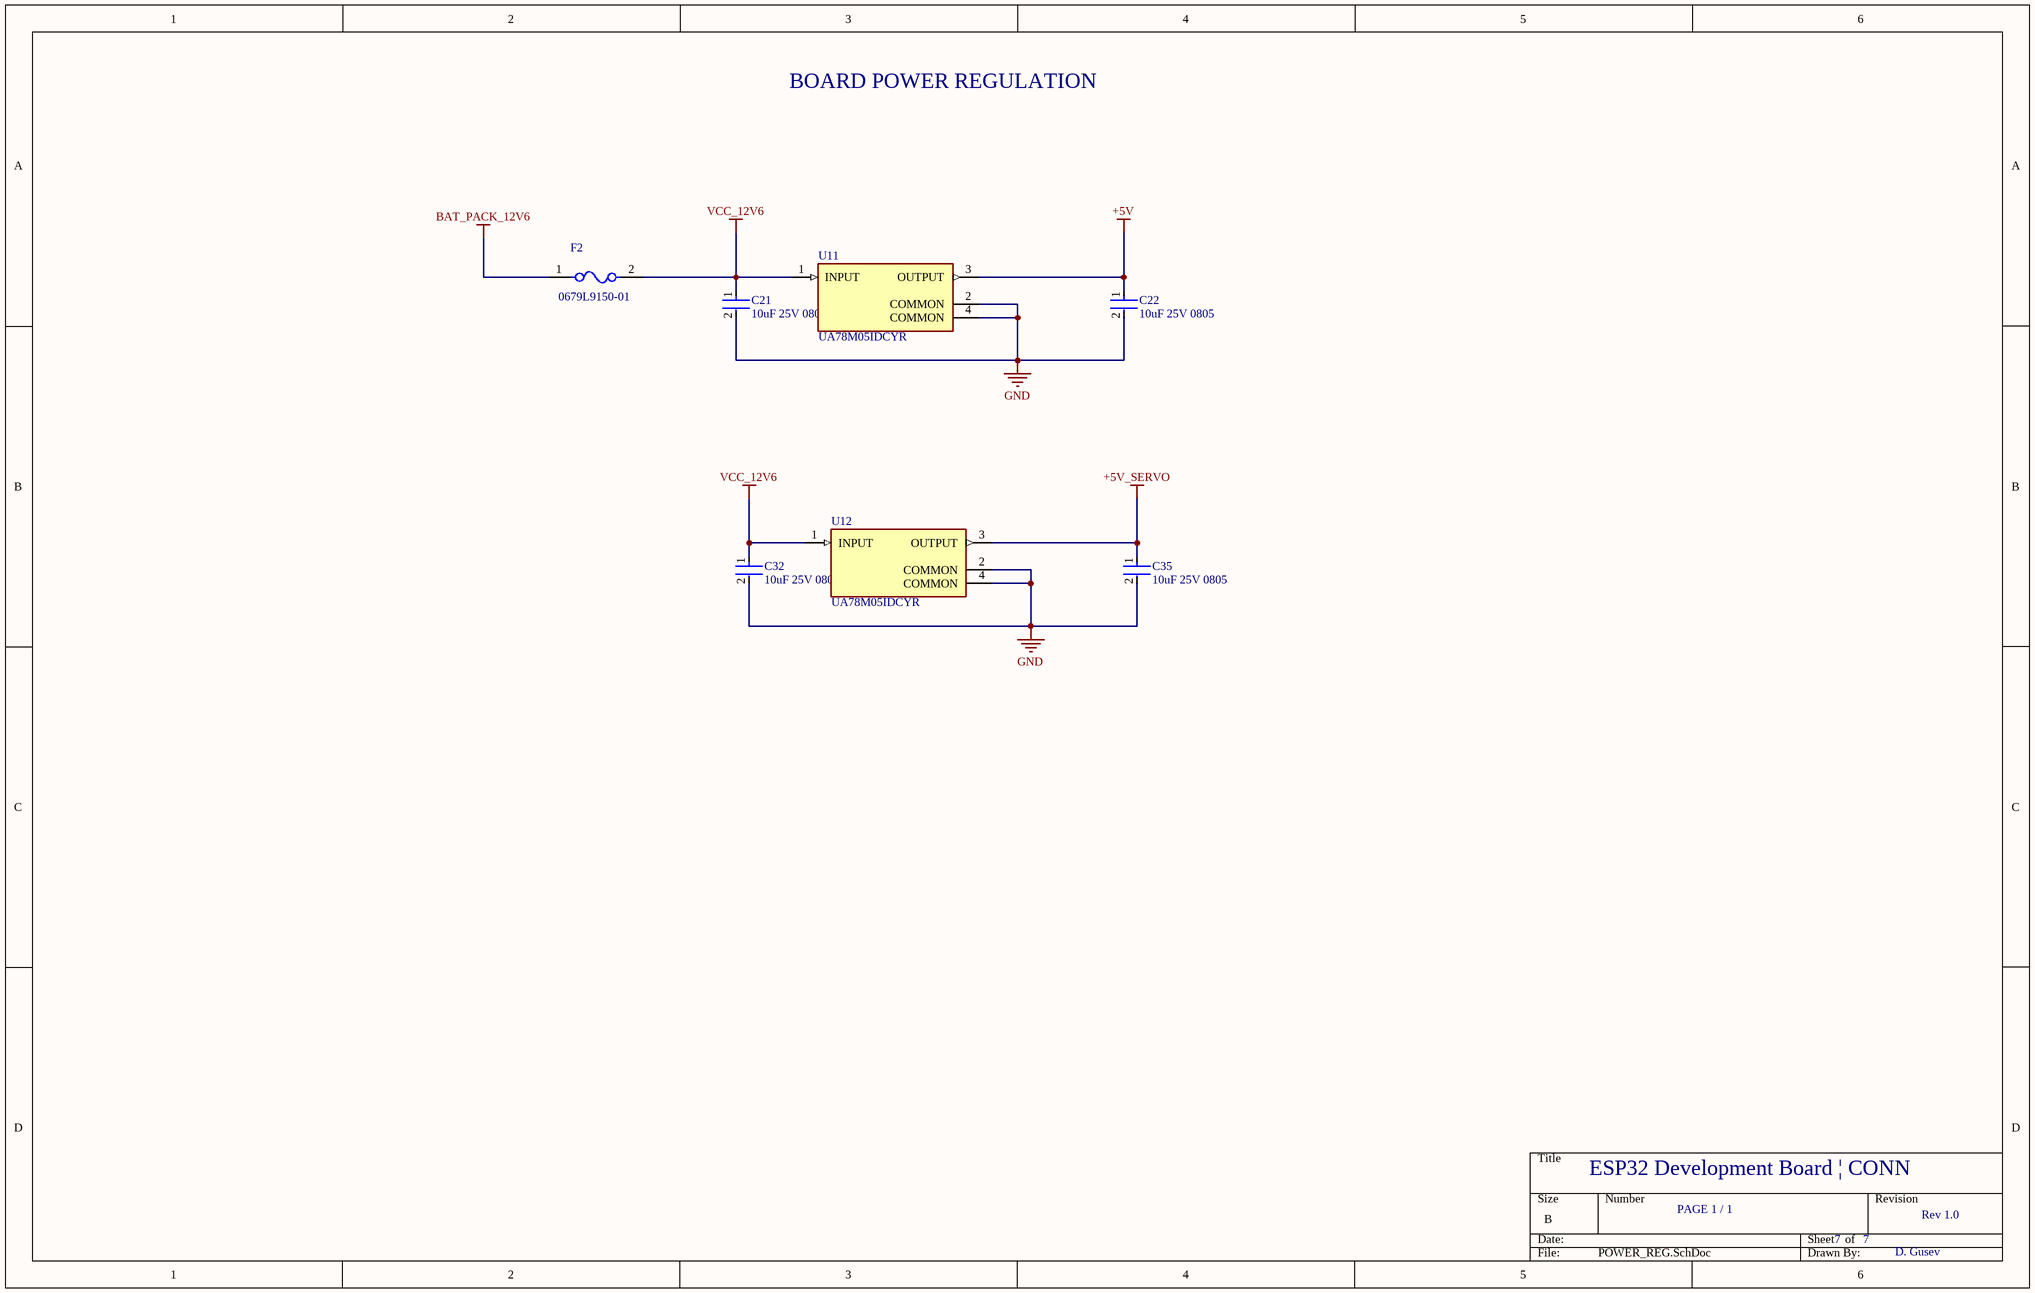
[diagram p6: POWER_REG.SchDoc]

### Parts
C21  10uF 25V 0805  [FP-GRM21B-0_15-IPC_C]
C22  10uF 25V 0805  [FP-GRM21B-0_15-IPC_C]
C32  10uF 25V 0805  [FP-GRM21B-0_15-IPC_C]
C35  10uF 25V 0805  [FP-GRM21B-0_15-IPC_C]
F2  0679L9150-01  [FP-0679L-MFG]
U11  UA78M05IDCYR  [FP-DCY0004A-MFG]
U12  UA78M05IDCYR  [FP-DCY0004A-MFG]

### Nets
+5V: C22.1 U11.3(OUTPUT)
+5V_SERVO: C35.1 U12.3(OUTPUT)
BAT_PACK_12V6: F2.1
GND: C21.2 C22.2 C32.2 C35.2 U11.2(COMMON) U11.4(COMMON) U12.2(COMMON) U12.4(COMMON)
VCC_12V6: C21.1 C32.1 F2.2 U11.1(INPUT) U12.1(INPUT)

### Notes on the sheet
- BOARD POWER REGULATION
- ESP32 Development Board | CONN
- PAGE 1 / 1
- 7
- Rev 1.0
- D. Gusev

### Library data of the parts
C21 C22 C32 C35 = CMP-2007-03541-2: as C1 on sheet USB-ESP32; Length: 2mm; Depth: 1.25mm; Termination: SMD/SMT; Voltage: 25V; Height: 1.25mm; Material: Ceramic; Thickness: 0.053inch; Radiation Hardening: No; Min Operating Temperature: -55°C; Width: 0.049inch; Package Quantity: 1; Mount: Surface Mount; Dielectric: X5R; Packaging: Tape and Reel; Capacitance: 10uF; Voltage Rating (DC): 25V; Lead Free: Lead Free; Max Operating Temperature: 85°C; Case Code (Imperial): 0805; Case/Package: 0805; Tolerance: 10%; Voltage Rating: 25V; Case Code (Metric): 2012
F2 = CMP-16042-000002-1: FUSE BRD MNT 15A 125VAC/VDC; Manufacturer: Bel Fuse; Max Fuse Ac Voltage: 125V; Fuse Blow Speed: Fast; Fuse I2T: 103.5A2Sec; Fuse Interrupt Ac Current: 50A; Automotive Grade: Grade 1; Value: 0.0038Ω; Fuse Interrupt Dc Current: 300A; Fuse Voltage Drop: 0.13V; Device Class L2: Fuses; ComponentLink2URL: https://www.belfuse.com/resources/CircuitProtection/datasheets/0679L%20Sep2016.pdf; Package: 0679L; Height: 2.79mm; Digikey Description: FUSE BRD MNT 15A 125VAC/VDC; Temperature Range High: +125°C; Device Class L3: unset; Octopart: https://octopart.com/0679l9150-01-bel+fuse-70850665; Temperature Range Low: -55°C; Fuse Current: 15A; Max Fuse Dc Voltage: 125V; Ipc Land Pattern Name: CAPC610254X254; Manufacturer Part Number: 0679L9150-01; Category: Fuse; Lead Free: Yes; Automotive: Yes; Resistance: 0.0038Ω; RoHS: TRUE; Device Class L1: Circuit Protection; ComponentLink2Description: Datasheet; Temperature: -55°C to +125°C; Voltage Rating: 125V
U11 U12 = CMP-04917-000030-1: IC REG LINEAR 5V 500MA SOT223-4; Manufacturer: Texas Instruments; Min Supply Voltage: 7V; Number Of Outputs: 1; Dropout Voltage: 2V; Max Supply Voltage: 25V; Output Type: Fixed; Max Junction Temp: +125°C; Standoff Height: 0.02mm; Automotive: No; Temperature Range Low: -40°C; Temperature Range High: +125°C; Package: DCY0004A; Lead Free: Yes; Octopart: https://octopart.com/ua78m05idcyr-texas+instruments-525575; Output Current: 500mA; ComponentLink2URL: http://www.ti.com/lit/ds/symlink/ua78m.pdf; Mouser Description: Linear Voltage Regulators 5V 500mA Fixed Pos Voltage Regulator; Device Class L1: Integrated Circuits (ICs); Device Class L3: Voltage Regulators - Linear; RoHS: TRUE; ComponentLink2Description: Datasheet; Output Voltage: 5V; Height: 1.8mm; Temperature: -40°C to +125°C; Manufacturer Part Number: UA78M05IDCYR; Digikey Description: IC REG LINEAR 5V 500MA SOT223-4; Category: IC; Device Class L2: Power Management ICs; Ipc Land Pattern Name: SOT230P700X180-4